# EAGLE schematic Blueberry Pi 7.1.2.esp32.no-lan.gsm-a9g.no-50p (EAGLE 6.1)

## Sheet 1 of 9: IO / LRADC / RTL8237BS / Touch / SPI Flash
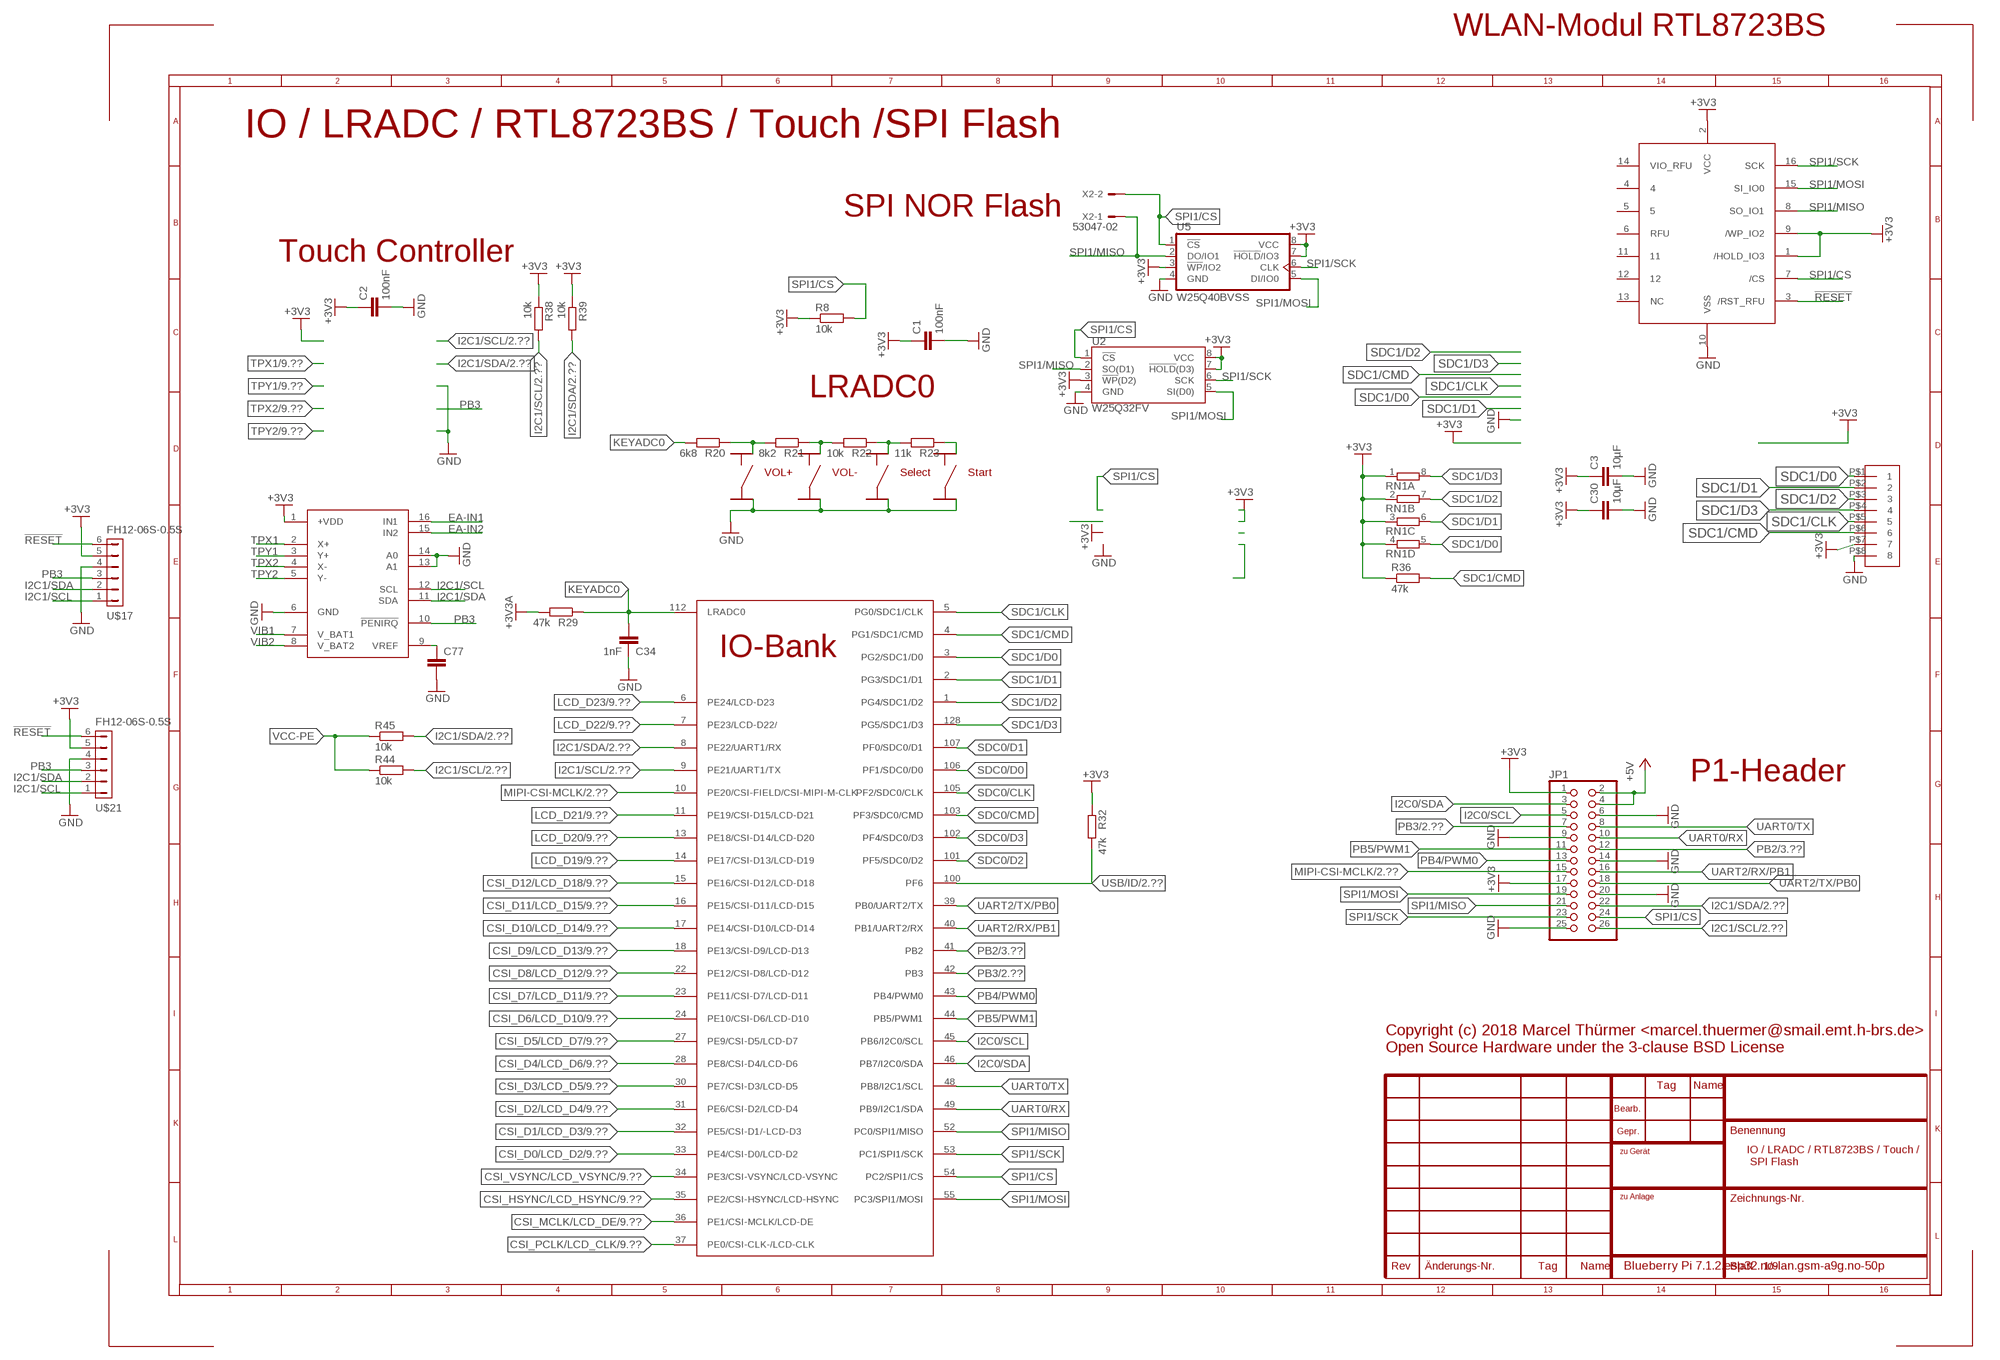
[diagram p0: schematic, sheet 1, part 1 of 2]
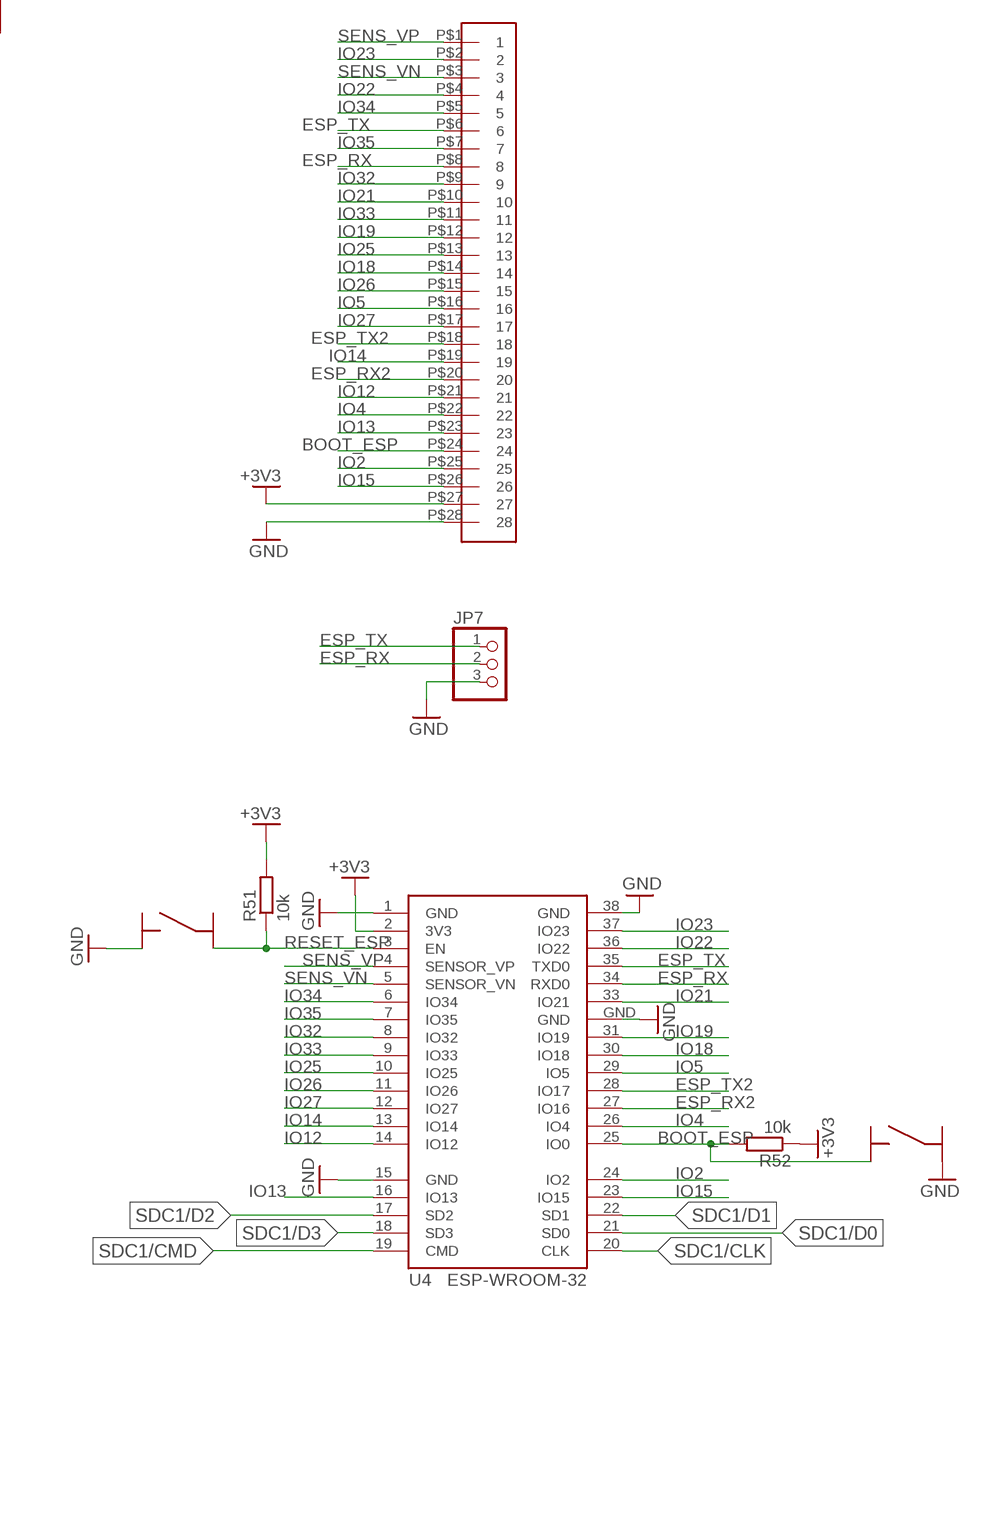
[diagram p1: schematic, sheet 1, part 2 of 2]

### Parts
C1  100nF  C-EUC0603  [C0603]
C2  100nF  C-EUC0603  [C0603]
C3  10µF  C-EUC0805  [C0805]
C30  10µF  C-EUC0805  [C0805]
C34  1nF  C-EUC0603  [C0603]
C77  C-EUC0603  [C0603]
JP1  PINHD-2X13  [2X13]
JP7  PINHD-1X3M  [1X03M]
R8  10k  R-EU_R0603  [R0603]
R20  6k8  R-EU_R0603  [R0603]
R21  8k2  R-EU_R0603  [R0603]
R22  10k  R-EU_R0603  [R0603]
R23  11k  R-EU_R0603  [R0603]
R29  47k  R-EU_R0603  [R0603]
R32  47k  R-EU_R0603  [R0603]
R36  47k  R-EU_R0603  [R0603]
R38  10k  R-EU_R0603  [R0603]
R39  10k  R-EU_R0603  [R0603]
R44  10k  R-EU_R0603  [R0603]
R45  10k  R-EU_R0603  [R0603]
R51  10k  R-EU_R0603  [R0603]
R52  10k  R-EU_R0603  [R0603]
RN1  4R-NEXB38V  [EXB38V]
S-BOOT-ESP  BUTTON_3X3MM_4PINS  [BUT_3X3_4PINS]
S-RST-ESP  BUTTON_3X3MM_4PINS  [BUT_3X3_4PINS]
S-SEL  BUTTON_3X3MM_4PINS  [BUT_3X3_4PINS]
S-START  BUTTON_3X3MM_4PINS  [BUT_3X3_4PINS]
S-VOL+  BUTTON_3X3MM_4PINS  [BUT_3X3_4PINS]
S-VOL-  BUTTON_3X3MM_4PINS  [BUT_3X3_4PINS]
U2  W25Q32FV  W25Q32FVZP  [WSON8-6X5MM]
U4  ESP-WROOM-32  [ESP-WROOM-32]
U5  W25Q40BVSS  [SO08-SS]
U$1  V3S  [QFP-128]
U$3  HDR-1.27MM-142  [HDR-1.27MM-19*2]
U$4  HDR-1.27MM-42  [HDR-1.27MM-4*2]
U$7  TSC2003  [TSSOP16]
U$16  S25FL256S  S25FLSXXX  [WSOIC-16]
U$17  FH12-06S-0.5S  [FH12-6S-0.5SH]
U$21  FH12-06S-0.5S  [FH12-6S-0.5SH]
X2  53047-02  [53047-02]

### Nets
!RESET: U$16.3(/RST_RFU) U$17.6 U$21.6 ; also sheet 3
+3V3: C1.1 C2.1 C3.1 C30.1 JP1.1 JP1.17 R8.1 R32.1 R36.1 R38.1 R39.1 R51.2 R52.1 RN1.1 RN1.2 RN1.3 RN1.4 U2.3(!WP!(D2)) U2.7(!HOLD!(D3)) U2.8(VCC) U4.2(3V3) U5.3(!WP!/IO2) U5.7(!HOLD!/IO3) U5.8(VCC) U$3.P$27 U$4.P$7 U$7.1(+VDD) U$16.1(/HOLD_IO3) U$16.2(VCC) U$16.9(/WP_IO2) U$17.5 U$21.5 ; also sheet 2,3,4,5,7,8,9
+3V3A: R29.2 ; also sheet 2,3
+5V: JP1.2 JP1.4 ; also sheet 2,3,5,6,7,9
BOOT_ESP: R52.2 S-BOOT-ESP.P$1 U4.25(IO0) U$3.P$24
CSI_D0/LCD_D2: U$1.33(PE4/CSI-D0/LCD-D2) ; also sheet 4,9
CSI_D1/LCD_D3: U$1.32(PE5/CSI-D1/-LCD-D3) ; also sheet 4,9
CSI_D2/LCD_D4: U$1.31(PE6/CSI-D2/LCD-D4) ; also sheet 4,9
CSI_D3/LCD_D5: U$1.30(PE7/CSI-D3/LCD-D5) ; also sheet 4,9
CSI_D4/LCD_D6: U$1.28(PE8/CSI-D4/LCD-D6) ; also sheet 4,9
CSI_D5/LCD_D7: U$1.27(PE9/CSI-D5/LCD-D7) ; also sheet 4,9
CSI_D6/LCD_D10: U$1.24(PE10/CSI-D6/LCD-D10) ; also sheet 4,9
CSI_D7/LCD_D11: U$1.23(PE11/CSI-D7/LCD-D11) ; also sheet 4,9
CSI_D8/LCD_D12: U$1.22(PE12/CSI-D8/LCD-D12) ; also sheet 4,9
CSI_D9/LCD_D13: U$1.18(PE13/CSI-D9/LCD-D13) ; also sheet 4,9
CSI_D10/LCD_D14: U$1.17(PE14/CSI-D10/LCD-D14) ; also sheet 4,9
CSI_D11/LCD_D15: U$1.16(PE15/CSI-D11/LCD-D15) ; also sheet 4,9
CSI_D12/LCD_D18: U$1.15(PE16/CSI-D12/LCD-D18) ; also sheet 4,9
CSI_HSYNC/LCD_HSYNC: U$1.35(PE2/CSI-HSYNC/LCD-HSYNC) ; also sheet 4,9
CSI_MCLK/LCD_DE: U$1.36(PE1/CSI-MCLK/LCD-DE) ; also sheet 4,9
CSI_PCLK/LCD_CLK: U$1.37(PE0/CSI-CLK-/LCD-CLK) ; also sheet 4,9
CSI_VSYNC/LCD_VSYNC: U$1.34(PE3/CSI-VSYNC/LCD-VSYNC) ; also sheet 4,9
EA-IN1: U$7.16(IN1) ; also sheet 9
EA-IN2: U$7.15(IN2) ; also sheet 9
ESP_RX: JP7.2 U4.34(RXD0) U$3.P$8
ESP_RX2: U4.27(IO16) U$3.P$20 ; also sheet 8
ESP_TX: JP7.1 U4.35(TXD0) U$3.P$6
ESP_TX2: U4.28(IO17) U$3.P$18 ; also sheet 8
GND: C1.2 C2.2 C3.2 C30.2 C34.1 C77.2 JP1.6 JP1.9 JP1.14 JP1.20 JP1.25 JP7.3 S-BOOT-ESP.P$2 S-RST-ESP.P$1 S-SEL.P$4 S-START.P$4 S-VOL+.P$4 S-VOL-.P$4 U2.4(GND) U4.1(GND) U4.15(GND) U4.38(GND) U4.GND U5.4(GND) U$3.P$28 U$4.P$8 U$7.6(GND) U$7.13(A1) U$7.14(A0) U$16.10(VSS) U$17.4 U$21.4 ; also sheet 2,3,4,5,6,7,8,9
I2C0/SCL: JP1.5 U$1.45(PB6/I2C0/SCL)
I2C0/SDA: JP1.3 U$1.46(PB7/I2C0/SDA)
I2C1/SCL: JP1.26 R38.2 R44.2 U$1.9(PE21/UART1/TX) U$7.12(SCL) U$17.1 U$21.1 ; also sheet 2,9
I2C1/SDA: JP1.22 R39.2 R45.2 U$1.8(PE22/UART1/RX) U$7.11(SDA) U$17.2 U$21.2 ; also sheet 2,9
IO2: U4.24(IO2) U$3.P$25
IO4: U4.26(IO4) U$3.P$22
IO5: U4.29(IO5) U$3.P$16
IO12: U4.14(IO12) U$3.P$21
IO13: U4.16(IO13) U$3.P$23
IO14: U4.13(IO14) U$3.P$19 ; also sheet 8
IO15: U4.23(IO15) U$3.P$26
IO18: U4.30(IO18) U$3.P$14
IO19: U4.31(IO19) U$3.P$12
IO21: U4.33(IO21) U$3.P$10
IO22: U4.36(IO22) U$3.P$4
IO23: U4.37(IO23) U$3.P$2
IO25: U4.10(IO25) U$3.P$13
IO26: U4.11(IO26) U$3.P$15
IO27: U4.12(IO27) U$3.P$17 ; also sheet 8
IO32: U4.8(IO32) U$3.P$9
IO33: U4.9(IO33) U$3.P$11
IO34: U4.6(IO34) U$3.P$5
IO35: U4.7(IO35) U$3.P$7
KEYADC0: C34.2 R20.2 R29.1 U$1.112(LRADC0)
LCD_D19: U$1.14(PE17/CSI-D13/LCD-D19) ; also sheet 4,9
LCD_D20: U$1.13(PE18/CSI-D14/LCD-D20) ; also sheet 4,9
LCD_D21: U$1.11(PE19/CSI-D15/LCD-D21) ; also sheet 4,9
LCD_D22: U$1.7(PE23/LCD-D22/) ; also sheet 4,9
LCD_D23: U$1.6(PE24/LCD-D23) ; also sheet 4,9
MIPI-CSI-MCLK: JP1.15 U$1.10(PE20/CSI-FIELD/CSI-MIPI-M-CLK) ; also sheet 2
N$8: R20.1 R21.2 S-VOL+.P$3
N$11: C77.1 U$7.9(VREF)
N$41: R21.1 R22.2 S-VOL-.P$3
N$42: R22.1 R23.2 S-SEL.P$3
N$43: R23.1 S-START.P$3
PB2: JP1.12 U$1.41(PB2) ; also sheet 3
PB3: JP1.7 U$1.42(PB3) U$7.10(!PENIRQ) U$17.3 U$21.3 ; also sheet 2
PB4/PWM0: JP1.13 U$1.43(PB4/PWM0) ; also sheet 3
PB5/PWM1: JP1.11 U$1.44(PB5/PWM1) ; also sheet 2,7
RESET_ESP: R51.1 S-RST-ESP.P$2 U4.3(EN)
SDC0/CLK: U$1.105(PF2/SDC0/CLK) ; also sheet 2
SDC0/CMD: U$1.103(PF3/SDC0/CMD) ; also sheet 2
SDC0/D0: U$1.106(PF1/SDC0/D0) ; also sheet 2
SDC0/D1: U$1.107(PF0/SDC0/D1) ; also sheet 2
SDC0/D2: U$1.101(PF5/SDC0/D2) ; also sheet 2
SDC0/D3: U$1.102(PF4/SDC0/D3) ; also sheet 2
SDC1/CLK: U4.20(CLK) U$1.5(PG0/SDC1/CLK) U$4.P$5
SDC1/CMD: R36.2 U4.19(CMD) U$1.4(PG1/SDC1/CMD) U$4.P$6
SDC1/D0: RN1.5 U4.21(SD0) U$1.3(PG2/SDC1/D0) U$4.P$1
SDC1/D1: RN1.6 U4.22(SD1) U$1.2(PG3/SDC1/D1) U$4.P$2
SDC1/D2: RN1.7 U4.17(SD2) U$1.1(PG4/SDC1/D2) U$4.P$3
SDC1/D3: RN1.8 U4.18(SD3) U$1.128(PG5/SDC1/D3) U$4.P$4
SENS_VN: U4.5(SENSOR_VN) U$3.P$3
SENS_VP: U4.4(SENSOR_VP) U$3.P$1
SPI1/CS: JP1.24 R8.2 U2.1(!CS!) U5.1(!CS!) U$1.54(PC2/SPI1/CS) U$16.7(/CS) X2.2
SPI1/MISO: JP1.21 U2.2(SO(D1)) U5.2(DO/IO1) U$1.52(PC0/SPI1/MISO) U$16.8(SO_IO1) X2.1
SPI1/MOSI: JP1.19 U2.5(SI(D0)) U5.5(DI/IO0) U$1.55(PC3/SPI1/MOSI) U$16.15(SI_IO0)
SPI1/SCK: JP1.23 U2.6(SCK) U5.6(CLK) U$1.53(PC1/SPI1/SCK) U$16.16(SCK)
TPX1: U$7.2(X+) ; also sheet 9
TPX2: U$7.4(X-) ; also sheet 9
TPY1: U$7.3(Y+) ; also sheet 9
TPY2: U$7.5(Y-) ; also sheet 9
UART0/RX: JP1.10 U$1.49(PB9/I2C1/SDA)
UART0/TX: JP1.8 U$1.48(PB8/I2C1/SCL)
UART2/RX/PB1: JP1.16 U$1.40(PB1/UART2/RX) ; also sheet 8
UART2/TX/PB0: JP1.18 U$1.39(PB0/UART2/TX) ; also sheet 8
USB/ID: R32.2 U$1.100(PF6) ; also sheet 2
VCC-PE: R44.1 R45.1
VIB1: U$7.7(V_BAT1) ; also sheet 9
VIB2: U$7.8(V_BAT2) ; also sheet 9
Unconnected: S-BOOT-ESP.P$3 S-BOOT-ESP.P$4 S-RST-ESP.P$3 S-RST-ESP.P$4 S-SEL.P$1 S-SEL.P$2 S-START.P$1 S-START.P$2 S-VOL+.P$1 S-VOL+.P$2 S-VOL-.P$1 S-VOL-.P$2 U$16.4 U$16.5 U$16.6(RFU) U$16.11 U$16.12 U$16.13(NC) U$16.14(VIO_RFU)

### Notes on the sheet
- WLAN-Modul RTL8723BS
- IO / LRADC / RTL8723BS / Touch /SPI Flash
- SPI NOR Flash
- Touch Controller
- LRADC0
- VOL+ | VOL- | Select | Start
- P1-Header
- Copyright (c) 2018 Marcel Thürmer <marcel.thuermer@smail.emt.h-brs.de>
  Open Source Hardware under the 3-clause BSD License
- IO / LRADC / RTL8723BS / Touch /
   SPI Flash

## Sheet 2 of 9: Ethernet / USB Host / SDC0 / Audio / MIPI CSI
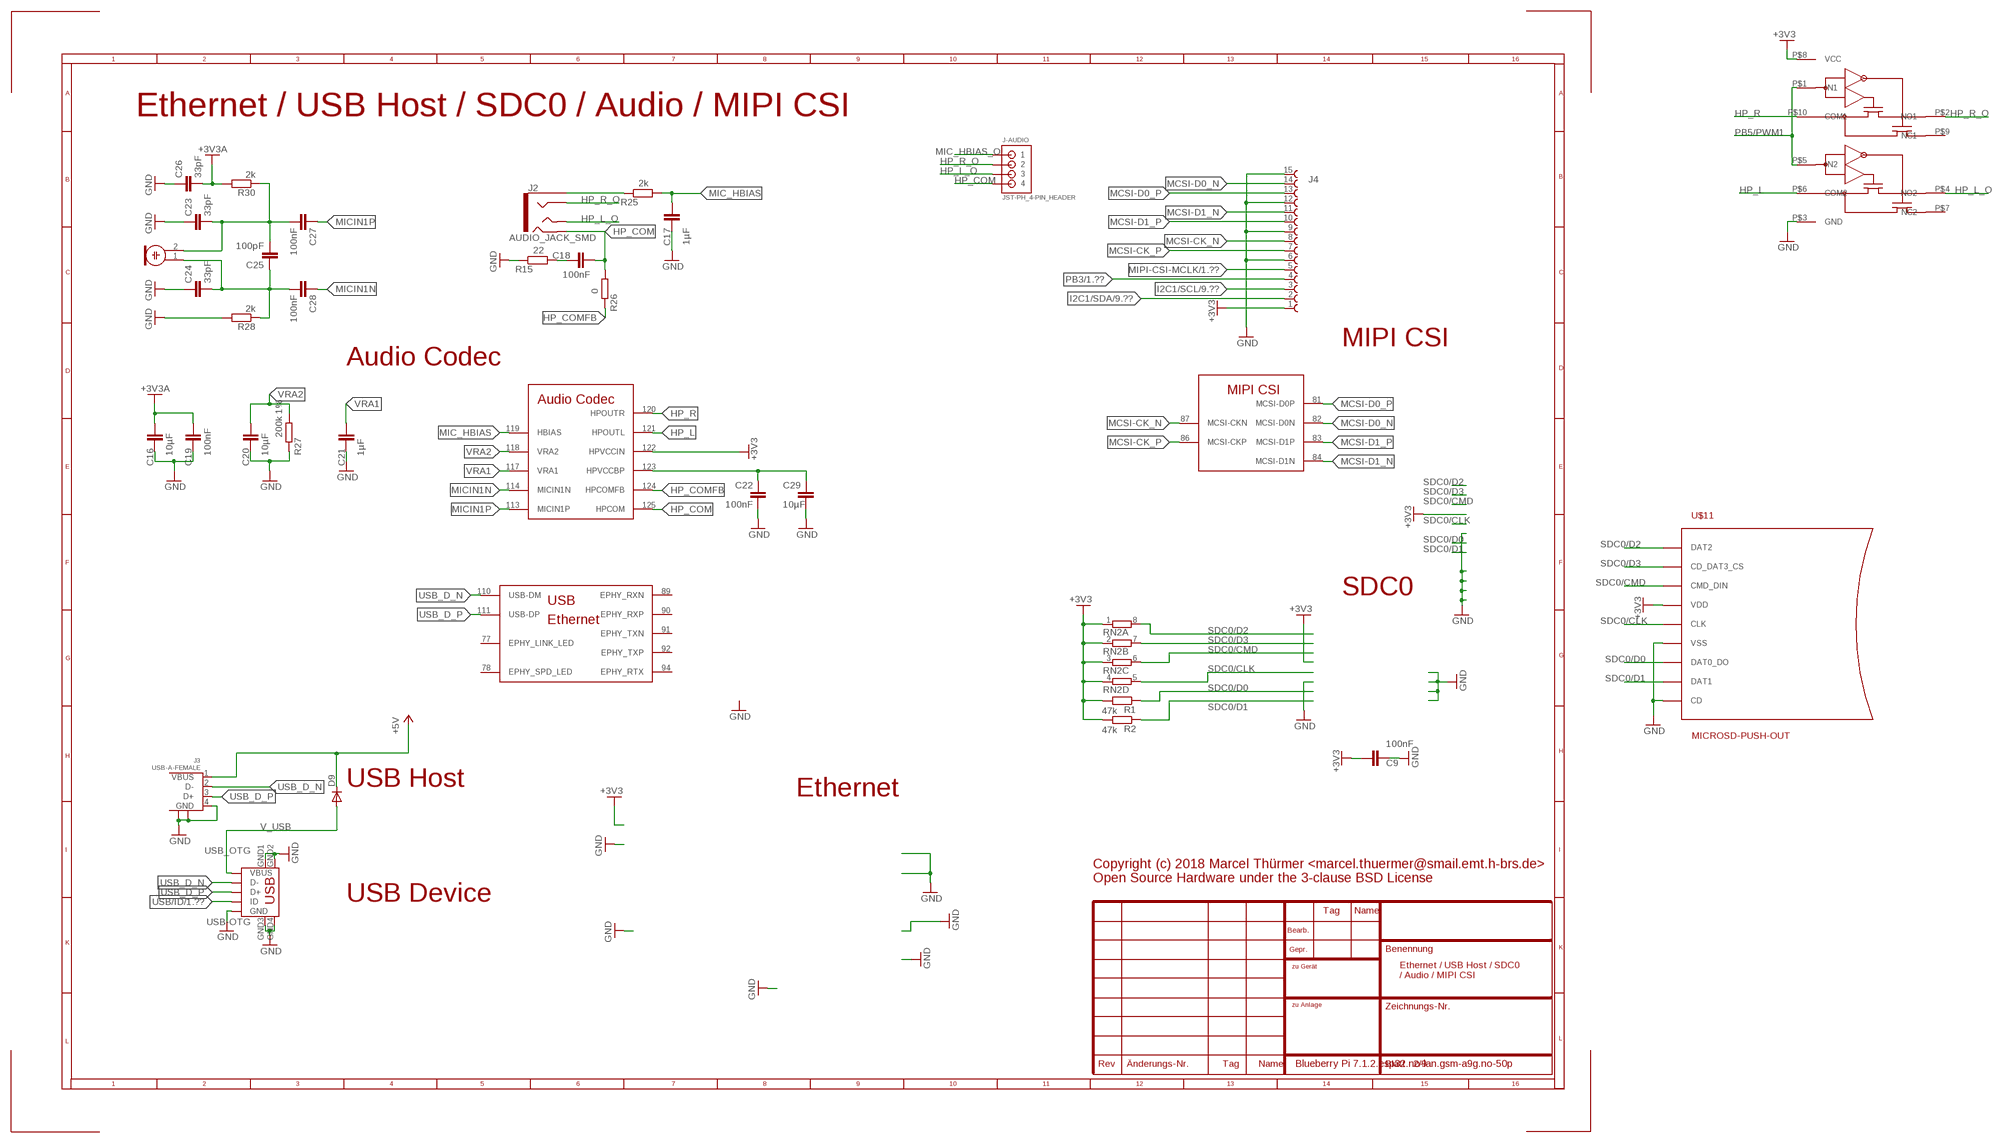
[diagram p2: schematic, sheet 2]

### Parts
C9  100nF  C-EUC0603  [C0603]
C16  10µF  C-EUC0805  [C0805]
C17  1µF  C-EUC0603  [C0603]
C18  100nF  C-EUC0603  [C0603]
C19  100nF  C-EUC0603  [C0603]
C20  10µF  C-EUC0805  [C0805]
C21  1µF  C-EUC0603  [C0603]
C22  100nF  C-EUC0603  [C0603]
C23  33pF  C-EUC0603  [C0603]
C24  33pF  C-EUC0603  [C0603]
C25  100pF  C-EUC0603  [C0603]
C26  33pF  C-EUC0603  [C0603]
C27  100nF  C-EUC0603  [C0603]
C28  100nF  C-EUC0603  [C0603]
C29  10µF  C-EUC0805  [C0805]
D9  DIODE-SOD323-W  [SOD323-W]
J2  AUDIO_JACK_SMD  AUDIO_JACK_TRRSSMD_RA  [AUDIO_JACK_3.5MM_TRRS_SMD_RA]
J3  USB-A-FEMALE  [USB-A-FEMALE]
J4  68611514122  [68611514122]
J-AUDIO  JST-PH_4-PIN_HEADER  [JST_B4B-PH_HEADER]
MIC  ELECTRET_MICROPHON-F6035AP  [F6035AP]
R1  47k  R-EU_R0603  [R0603]
R2  47k  R-EU_R0603  [R0603]
R15  22  R-EU_R0603  [R0603]
R25  2k  R-EU_R0603  [R0603]
R26  0  R-EU_R0603  [R0603]
R27  200k 1%  R-EU_R0603  [R0603]
R28  2k  R-EU_R0603  [R0603]
R30  2k  R-EU_R0603  [R0603]
RN2  4R-NEXB38V  [EXB38V]
U$11  MICROSD-PUSH-OUT  [MICROSD-PUSH-OUT]
U$24  TS5A23157  [TS5A23157]
USB_OTG  USB-OTG  MINI_USB9  [USB_MINI_9PIN]

### Nets
+3V3: C9.1 J4.1 R1.2 R2.2 RN2.1 RN2.2 RN2.3 RN2.4 U$1.122(HPVCCIN) U$11.4(VDD) U$24.P$8(VCC) ; also sheet 1,3,4,5,7,8,9
+3V3A: C16.2 C19.2 C26.2 R30.2 ; also sheet 1,3
+5V: D9.C J3.1(VBUS) ; also sheet 1,3,5,6,7,9
GND: C9.2 C16.1 C17.2 C19.1 C20.1 C21.1 C22.2 C23.1 C24.1 C26.1 C29.1 J3.4(GND) J3.P$1 J3.P$2 J4.6 J4.9 J4.12 J4.15 R15.1 R27.1 R28.2 U$11.6(VSS) U$11.CD U$11.G1(VSS) U$11.G2(VSS) U$11.G3(VSS) U$11.G4(VSS) U$24.P$3(GND) USB_OTG.GND USB_OTG.GND1 USB_OTG.GND2 USB_OTG.GND3 USB_OTG.GND4 ; also sheet 1,3,4,5,6,7,8,9
HP_COM: C18.2 J2.RING2 J-AUDIO.P4 R26.2 U$1.125(HPCOM)
HP_COMFB: R26.1 U$1.124(HPCOMFB)
HP_L: U$1.121(HPOUTL) U$24.P$6(COM2)
HP_L_O: J2.TIP J-AUDIO.P3 U$24.P$4(NO2)
HP_R: U$1.120(HPOUTR) U$24.P$10(COM1) ; also sheet 7
HP_R_O: J2.RING1 J-AUDIO.P2 U$24.P$2(NO1)
I2C1/SCL: J4.3 ; also sheet 1,9
I2C1/SDA: J4.2 ; also sheet 1,9
MCSI-CK_N: J4.8 U$1.87(MCSI-CKN)
MCSI-CK_P: J4.7 U$1.86(MCSI-CKP)
MCSI-D0_N: J4.14 U$1.82(MCSI-D0N)
MCSI-D0_P: J4.13 U$1.81(MCSI-D0P)
MCSI-D1_N: J4.11 U$1.84(MCSI-D1N)
MCSI-D1_P: J4.10 U$1.83(MCSI-D1P)
MIC_HBIAS: C17.1 R25.2 U$1.119(HBIAS)
MIC_HBIAS_O: J2.EARTH J-AUDIO.P1 R25.1
MICIN1N: C28.1 U$1.114(MICIN1N)
MICIN1P: C27.1 U$1.113(MICIN1P) ; also sheet 7
MIPI-CSI-MCLK: J4.5 ; also sheet 1
N$28: C22.1 C29.2 U$1.123(HPVCCBP)
N$47: C18.1 R15.2
N$48: C23.2 C25.2 C27.2 MIC.2 R30.1
N$49: C24.2 C25.1 C28.2 MIC.1 R28.1
PB3: J4.4 ; also sheet 1
PB5/PWM1: U$24.P$1(IN1) U$24.P$5(IN2) ; also sheet 1,7
SDC0/CLK: RN2.5 U$11.5(CLK) ; also sheet 1
SDC0/CMD: RN2.6 U$11.3(CMD_DIN) ; also sheet 1
SDC0/D0: R1.1 U$11.7(DAT0_DO) ; also sheet 1
SDC0/D1: R2.1 U$11.8(DAT1) ; also sheet 1
SDC0/D2: RN2.8 U$11.1(DAT2) ; also sheet 1
SDC0/D3: RN2.7 U$11.2(CD_DAT3_CS) ; also sheet 1
USB/ID: USB_OTG.ID ; also sheet 1
USB_D_N: J3.2(D-) U$1.110(USB-DM) USB_OTG.D-
USB_D_P: J3.3(D+) U$1.111(USB-DP) USB_OTG.D+
V_USB: D9.A USB_OTG.VBUS ; also sheet 3,6,8
VRA1: C21.2 U$1.117(VRA1)
VRA2: C20.2 R27.2 U$1.118(VRA2)
Unconnected: U$1.77(EPHY_LINK_LED) U$1.78(EPHY_SPD_LED) U$1.89(EPHY_RXN) U$1.90(EPHY_RXP) U$1.91(EPHY_TXN) U$1.92(EPHY_TXP) U$1.94(EPHY_RTX) U$24.P$7(NC2) U$24.P$9(NC1)

### Notes on the sheet
- Ethernet / USB Host / SDC0 / Audio / MIPI CSI
- MIPI CSI
- Audio Codec
- SDC0
- USB Host
- Ethernet
- Copyright (c) 2018 Marcel Thürmer <marcel.thuermer@smail.emt.h-brs.de>
  Open Source Hardware under the 3-clause BSD License
- USB Device
- Ethernet / USB Host / SDC0 
  / Audio / MIPI CSI

## Sheet 3 of 9: VCC / RTC / PLL
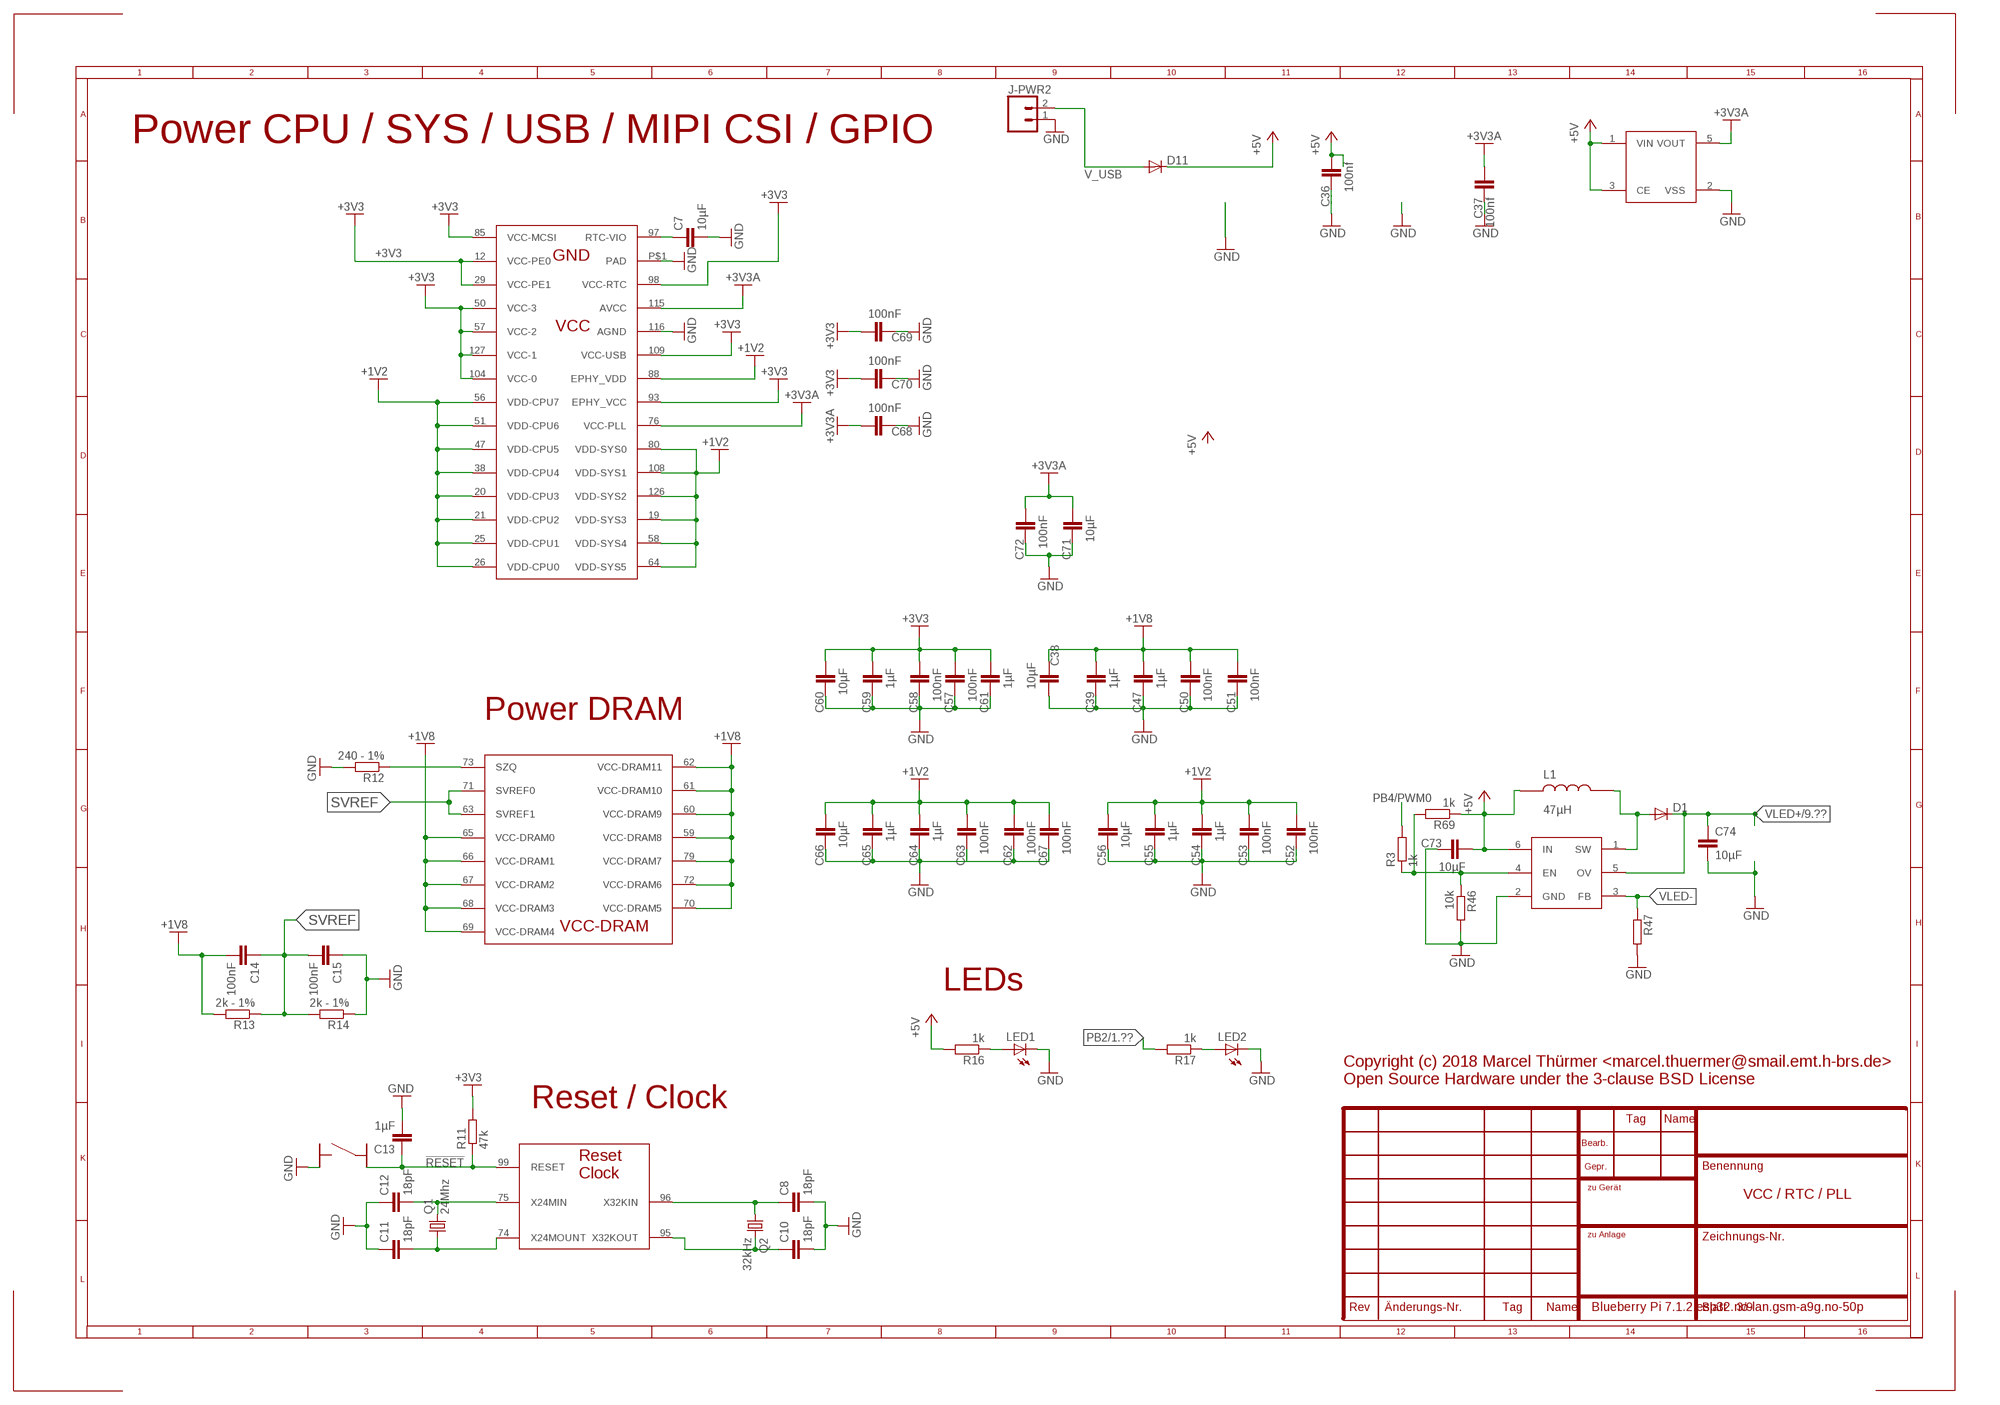
[diagram p3: schematic, sheet 3]

### Parts
C7  10µF  C-EUC0805  [C0805]
C8  18pF  C-EUC0603  [C0603]
C10  18pF  C-EUC0603  [C0603]
C11  18pF  C-EUC0603  [C0603]
C12  18pF  C-EUC0603  [C0603]
C13  1µF  C-EUC0603  [C0603]
C14  100nF  C-EUC0603  [C0603]
C15  100nF  C-EUC0603  [C0603]
C36  100nf  C-EUC0603  [C0603]
C37  100nf  C-EUC0603  [C0603]
C38  10µF  C-EUC0805  [C0805]
C39  1µF  C-EUC0603  [C0603]
C47  1µF  C-EUC0603  [C0603]
C50  100nF  C-EUC0603  [C0603]
C51  100nF  C-EUC0603  [C0603]
C52  100nF  C-EUC0603  [C0603]
C53  100nF  C-EUC0603  [C0603]
C54  1µF  C-EUC0603  [C0603]
C55  1µF  C-EUC0603  [C0603]
C56  10µF  C-EUC0805  [C0805]
C57  100nF  C-EUC0603  [C0603]
C58  100nF  C-EUC0603  [C0603]
C59  1µF  C-EUC0603  [C0603]
C60  10µF  C-EUC0805  [C0805]
C61  1µF  C-EUC0603  [C0603]
C62  100nF  C-EUC0603  [C0603]
C63  100nF  C-EUC0603  [C0603]
C64  1µF  C-EUC0603  [C0603]
C65  1µF  C-EUC0603  [C0603]
C66  10µF  C-EUC0805  [C0805]
C67  100nF  C-EUC0603  [C0603]
C68  100nF  C-EUC0603  [C0603]
C69  100nF  C-EUC0603  [C0603]
C70  100nF  C-EUC0603  [C0603]
C71  10µF  C-EUC0805  [C0805]
C72  100nF  C-EUC0603  [C0603]
C73  10µF  C-EUC0805  [C0805]
C74  10µF  C-EUC0805  [C0805]
D1  DIODE-SOD323-W  [SOD323-W]
D11  DIODE-SOD323-W  [SOD323-W]
J-PWR2  CONN_02  [1X02]
L1  47µH  INDUCTANCE_CD32  [CD32]
LED1  LEDCHIPLED_0805  [CHIPLED_0805]
LED2  LEDCHIPLED_0805  [CHIPLED_0805]
Q1  24Mhz  CRYSTALHC49U-V  [HC49U-V]
Q2  32kHz  CRYSTALTC38H  [TC38H]
R3  1k  R-EU_R0603  [R0603]
R11  47k  R-EU_R0603  [R0603]
R12  240 - 1%  R-EU_R0603  [R0603]
R13  2k - 1%  R-EU_R0603  [R0603]
R14  2k - 1%  R-EU_R0603  [R0603]
R16  1k  R-EU_R0603  [R0603]
R17  1k  R-EU_R0603  [R0603]
R46  10k  R-EU_R0603  [R0603]
R47  R-EU_R0603  [R0603]
R69  1k  R-EU_R0603  [R0603]
S-RST  BUTTON_3X3MM_4PINS  [BUT_3X3_4PINS]
U$9  PT4101  [SOT23-6]
U$15  XC6204  XC6204XC6204  [SOT25]

### Nets
!RESET: C13.1 R11.1 S-RST.P$2 U$1.99(RESET) ; also sheet 1
+1V2: C52.1 C53.1 C54.1 C55.1 C56.1 C62.1 C63.1 C64.1 C65.1 C66.1 C67.1 U$1.19(VDD-SYS3) U$1.20(VDD-CPU3) U$1.21(VDD-CPU2) U$1.25(VDD-CPU1) U$1.26(VDD-CPU0) U$1.38(VDD-CPU4) U$1.47(VDD-CPU5) U$1.51(VDD-CPU6) U$1.56(VDD-CPU7) U$1.58(VDD-SYS4) U$1.64(VDD-SYS5) U$1.80(VDD-SYS0) U$1.88(EPHY_VDD) U$1.108(VDD-SYS1) U$1.126(VDD-SYS2) ; also sheet 5,9
+1V8: C14.2 C38.2 C39.1 C47.1 C50.1 C51.1 R13.2 U$1.59(VCC-DRAM8) U$1.60(VCC-DRAM9) U$1.61(VCC-DRAM10) U$1.62(VCC-DRAM11) U$1.65(VCC-DRAM0) U$1.66(VCC-DRAM1) U$1.67(VCC-DRAM2) U$1.68(VCC-DRAM3) U$1.69(VCC-DRAM4) U$1.70(VCC-DRAM5) U$1.72(VCC-DRAM6) U$1.79(VCC-DRAM7) ; also sheet 5,9
+3V3: C57.1 C58.1 C59.1 C60.1 C61.1 C69.1 C70.1 R11.2 U$1.12(VCC-PE0) U$1.29(VCC-PE1) U$1.50(VCC-3) U$1.57(VCC-2) U$1.85(VCC-MCSI) U$1.93(EPHY_VCC) U$1.98(VCC-RTC) U$1.104(VCC-0) U$1.109(VCC-USB) U$1.127(VCC-1) ; also sheet 1,2,4,5,7,8,9
+3V3A: C37.1 C68.1 C71.1 C72.1 U$1.76(VCC-PLL) U$1.115(AVCC) U$15.5(VOUT) ; also sheet 1,2
+5V: C36.1 C73.1 D11.C L1.P$1 R16.2 R69.1 U$9.6(IN) U$15.1(VIN) U$15.3(CE) ; also sheet 1,2,5,6,7,9
GND: C7.2 C8.2 C10.2 C11.1 C12.1 C13.2 C15.1 C36.2 C37.2 C38.1 C39.2 C47.2 C50.2 C51.2 C52.2 C53.2 C54.2 C55.2 C56.2 C57.2 C58.2 C59.2 C60.2 C61.2 C62.2 C63.2 C64.2 C65.2 C66.2 C67.2 C68.2 C69.2 C70.2 C71.2 C72.2 C73.2 C74.2 J-PWR2.1 LED1.C LED2.C R12.2 R14.1 R46.2 R47.2 S-RST.P$1 U$1.116(AGND) U$1.P$1(PAD) U$9.2(GND) U$15.2(VSS) ; also sheet 1,2,4,5,6,7,8,9
N$3: LED1.A R16.1
N$6: LED2.A R17.1
N$9: R3.1 R46.1 R69.2 U$9.4(EN)
N$10: D1.A L1.P$2 U$9.1(SW)
N$23: C7.1 U$1.97(RTC-VIO)
N$29: C10.1 Q2.2 U$1.95(X32KOUT)
N$30: C8.1 Q2.1 U$1.96(X32KIN)
N$32: C11.2 Q1.1 U$1.74(X24MOUNT)
N$33: C12.2 Q1.2 U$1.75(X24MIN)
N$36: R12.1 U$1.73(SZQ)
PB2: R17.2 ; also sheet 1
PB4/PWM0: R3.2 ; also sheet 1
SVREF: C14.1 C15.2 R13.1 R14.2 U$1.63(SVREF1) U$1.71(SVREF0)
V_USB: D11.A J-PWR2.2 ; also sheet 2,6,8
VLED+: C74.1 D1.C U$9.5(OV) ; also sheet 9
VLED-: R47.1 U$9.3(FB) ; also sheet 9
Unconnected: S-RST.P$3 S-RST.P$4

### Notes on the sheet
- Power CPU / SYS / USB / MIPI CSI / GPIO
- Power DRAM
- LEDs
- Copyright (c) 2018 Marcel Thürmer <marcel.thuermer@smail.emt.h-brs.de>
  Open Source Hardware under the 3-clause BSD License
- Reset / Clock
- VCC / RTC / PLL

## Sheet 4 of 9: sn65lvds84
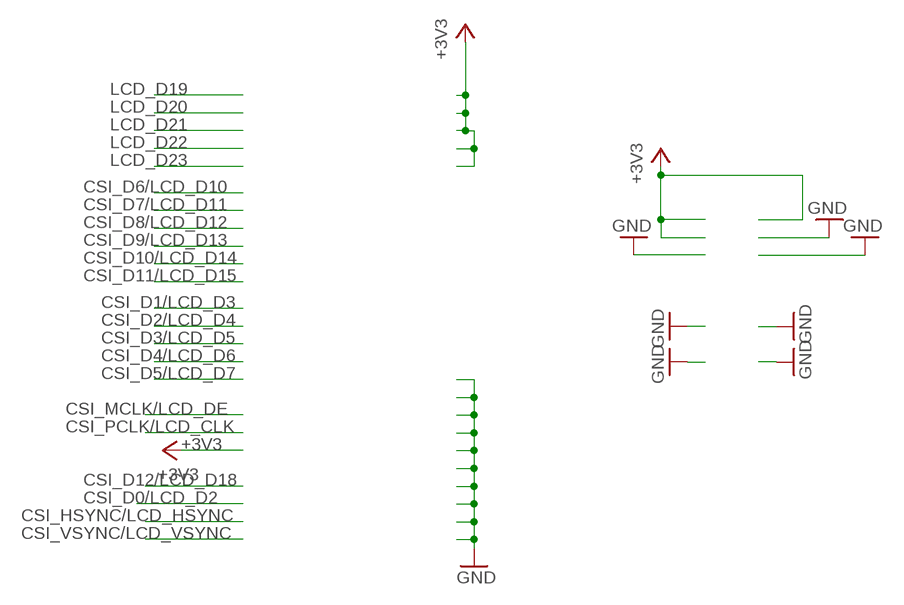
[diagram p4: schematic, sheet 4]

## Sheet 5 of 9
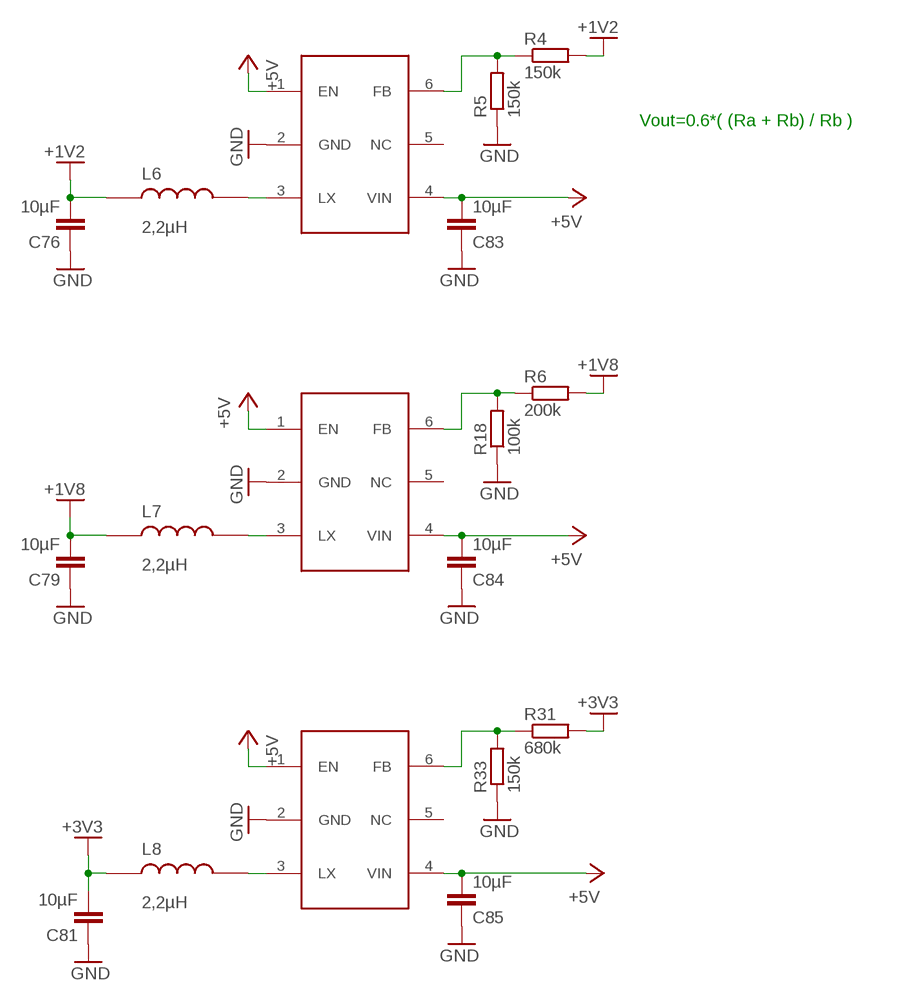
[diagram p5: schematic, sheet 5]

### Parts
C76  10µF  C-EUC0805  [C0805]
C79  10µF  C-EUC0805  [C0805]
C81  10µF  C-EUC0805  [C0805]
C83  10µF  C-EUC0805  [C0805]
C84  10µF  C-EUC0805  [C0805]
C85  10µF  C-EUC0805  [C0805]
L6  2,2µH  INDUCTANCE_CD32  [CD32]
L7  2,2µH  INDUCTANCE_CD32  [CD32]
L8  2,2µH  INDUCTANCE_CD32  [CD32]
R4  150k  R-EU_R0603  [R0603]
R5  150k  R-EU_R0603  [R0603]
R6  200k  R-EU_R0603  [R0603]
R18  100k  R-EU_R0603  [R0603]
R31  680k  R-EU_R0603  [R0603]
R33  150k  R-EU_R0603  [R0603]
U$5  STI3411  [SOT23-6]
U$12  STI3411  [SOT23-6]
U$13  STI3411  [SOT23-6]

### Nets
+1V2: C76.2 L6.P$1 R4.2 ; also sheet 3,9
+1V8: C79.2 L7.P$1 R6.2 ; also sheet 3,9
+3V3: C81.2 L8.P$1 R31.2 ; also sheet 1,2,3,4,7,8,9
+5V: C83.2 C84.2 C85.2 U$5.1(EN) U$5.4(VIN) U$12.1(EN) U$12.4(VIN) U$13.1(EN) U$13.4(VIN) ; also sheet 1,2,3,6,7,9
GND: C76.1 C79.1 C81.1 C83.1 C84.1 C85.1 R5.1 R18.1 R33.1 U$5.2(GND) U$12.2(GND) U$13.2(GND) ; also sheet 1,2,3,4,6,7,8,9
N$2: L6.P$2 U$13.3(LX)
N$5: L7.P$2 U$5.3(LX)
N$15: R4.1 R5.2 U$13.6(FB)
N$16: L8.P$2 U$12.3(LX)
N$26: R6.1 R18.2 U$5.6(FB)
N$31: R31.1 R33.2 U$12.6(FB)
Unconnected: U$5.5(NC) U$12.5(NC) U$13.5(NC)

### Notes on the sheet
- Vout=0.6*( (Ra + Rb) / Rb )

## Sheet 6 of 9
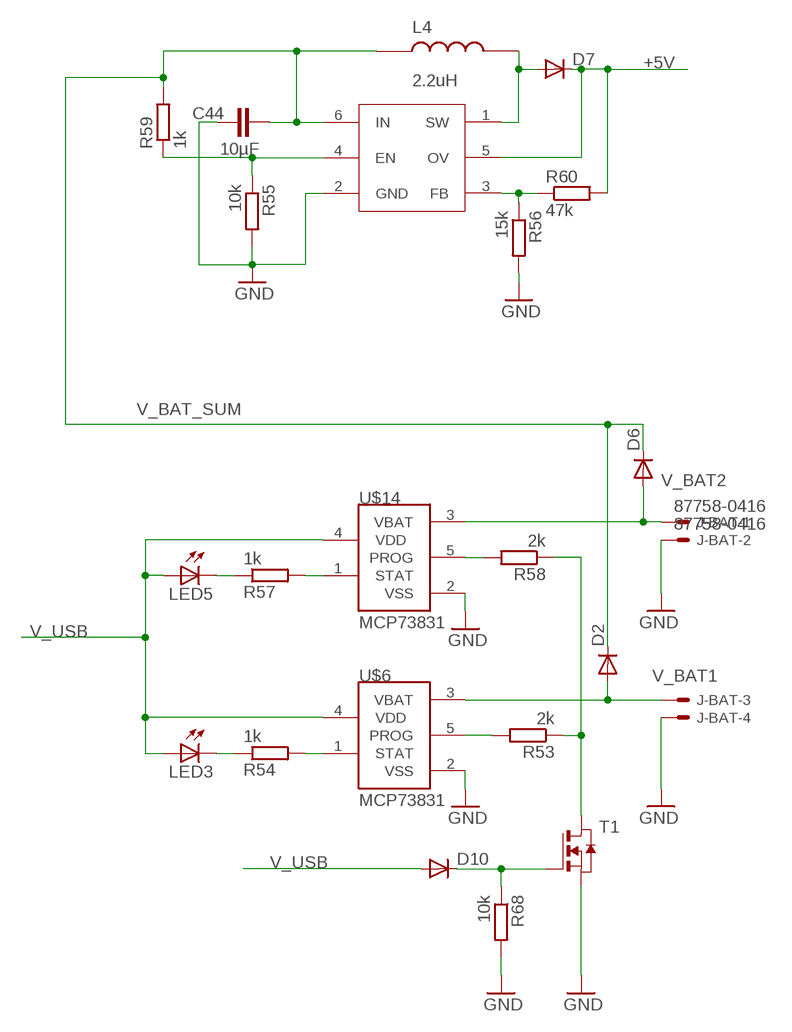
[diagram p6: schematic, sheet 6]

### Parts
C44  10µF  C-EUC0805  [C0805]
D2  DIODE-DO214AC  [DO214AC]
D6  DIODE-DO214AC  [DO214AC]
D7  DIODE-SOD323-W  [SOD323-W]
D10  DIODE-SOD323-W  [SOD323-W]
J-BAT  87758-0416  [87758-0416]
L4  2.2uH  INDUCTANCE_CD32  [CD32]
LED3  LEDCHIPLED_0805  [CHIPLED_0805]
LED5  LEDCHIPLED_0805  [CHIPLED_0805]
R53  2k  R-EU_R0603  [R0603]
R54  1k  R-EU_R0603  [R0603]
R55  10k  R-EU_R0603  [R0603]
R56  15k  R-EU_R0603  [R0603]
R57  1k  R-EU_R0603  [R0603]
R58  2k  R-EU_R0603  [R0603]
R59  1k  R-EU_R0603  [R0603]
R60  47k  R-EU_R0603  [R0603]
R68  10k  R-EU_R0603  [R0603]
T1  NMOSSOT23  [SOT-23]
U$6  MCP73831  [SOT23-5L]
U$10  PT4101  [SOT23-6]
U$14  MCP73831  [SOT23-5L]

### Nets
+5V: D7.C R60.2 U$10.5(OV) ; also sheet 1,2,3,5,7,9
GND: C44.2 J-BAT.2 J-BAT.4 R55.2 R56.2 R68.2 T1.2(S) U$6.2(VSS) U$10.2(GND) U$14.2(VSS) ; also sheet 1,2,3,4,5,7,8,9
N$1: R53.1 R58.1 T1.1(D)
N$7: R56.1 R60.1 U$10.3(FB)
N$12: R55.1 R59.1 U$10.4(EN)
N$13: D7.A L4.P$2 U$10.1(SW)
N$18: D10.C R68.1 T1.3(G)
N$19: R53.2 U$6.5(PROG)
N$35: LED3.C R54.1
N$38: R54.2 U$6.1(STAT)
N$46: R58.2 U$14.5(PROG)
N$50: R57.2 U$14.1(STAT)
N$51: LED5.C R57.1
V_BAT1: D2.A J-BAT.3 U$6.3(VBAT)
V_BAT2: D6.A J-BAT.1 U$14.3(VBAT)
V_BAT_SUM: C44.1 D2.C D6.C L4.P$1 R59.2 U$10.6(IN) ; also sheet 7,8
V_USB: D10.A LED3.A LED5.A U$6.4(VDD) U$14.4(VDD) ; also sheet 2,3,8

## Sheet 7 of 9
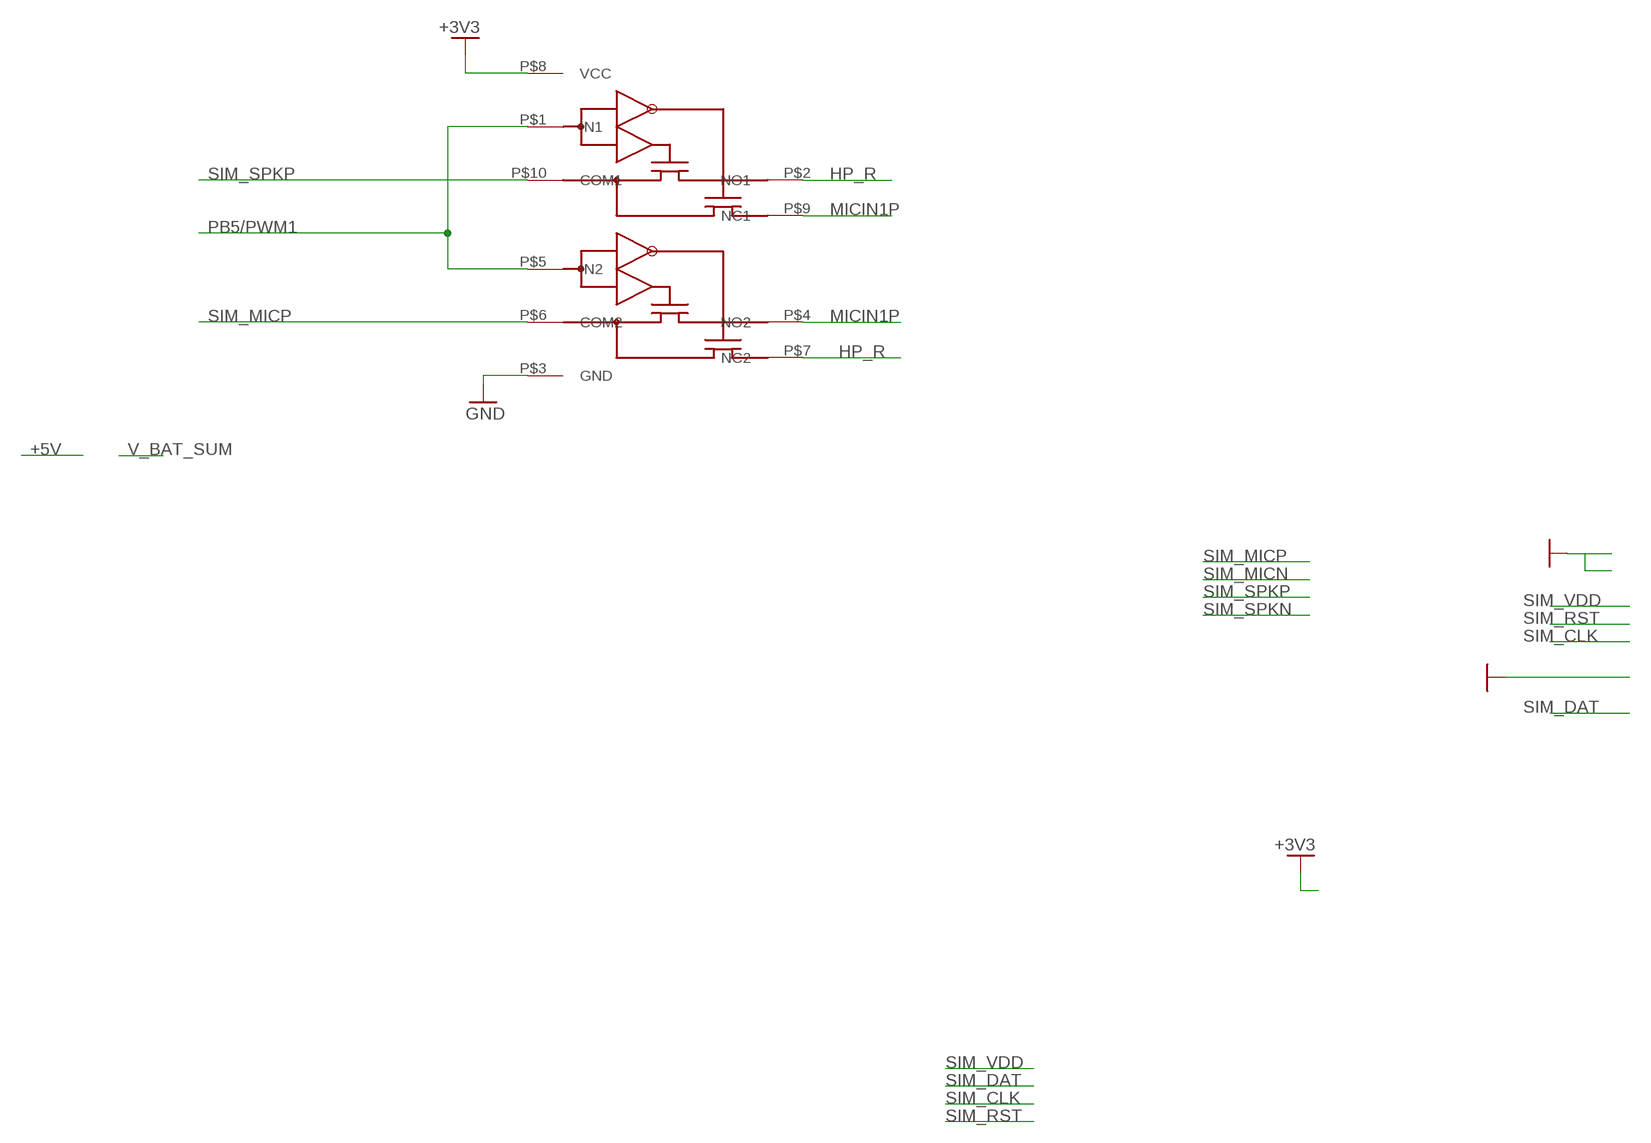
[diagram p7: schematic, sheet 7]

### Parts
U$19  TS5A23157  [TS5A23157]

### Nets
+3V3: U$19.P$8(VCC) ; also sheet 1,2,3,4,5,8,9
GND: U$19.P$3(GND) ; also sheet 1,2,3,4,5,6,8,9
HP_R: U$19.P$2(NO1) U$19.P$7(NC2) ; also sheet 2
MICIN1P: U$19.P$4(NO2) U$19.P$9(NC1) ; also sheet 2
PB5/PWM1: U$19.P$1(IN1) U$19.P$5(IN2) ; also sheet 1,2
SIM_MICP: U$19.P$6(COM2) ; also sheet 8
SIM_SPKP: U$19.P$10(COM1) ; also sheet 8

## Sheet 8 of 9
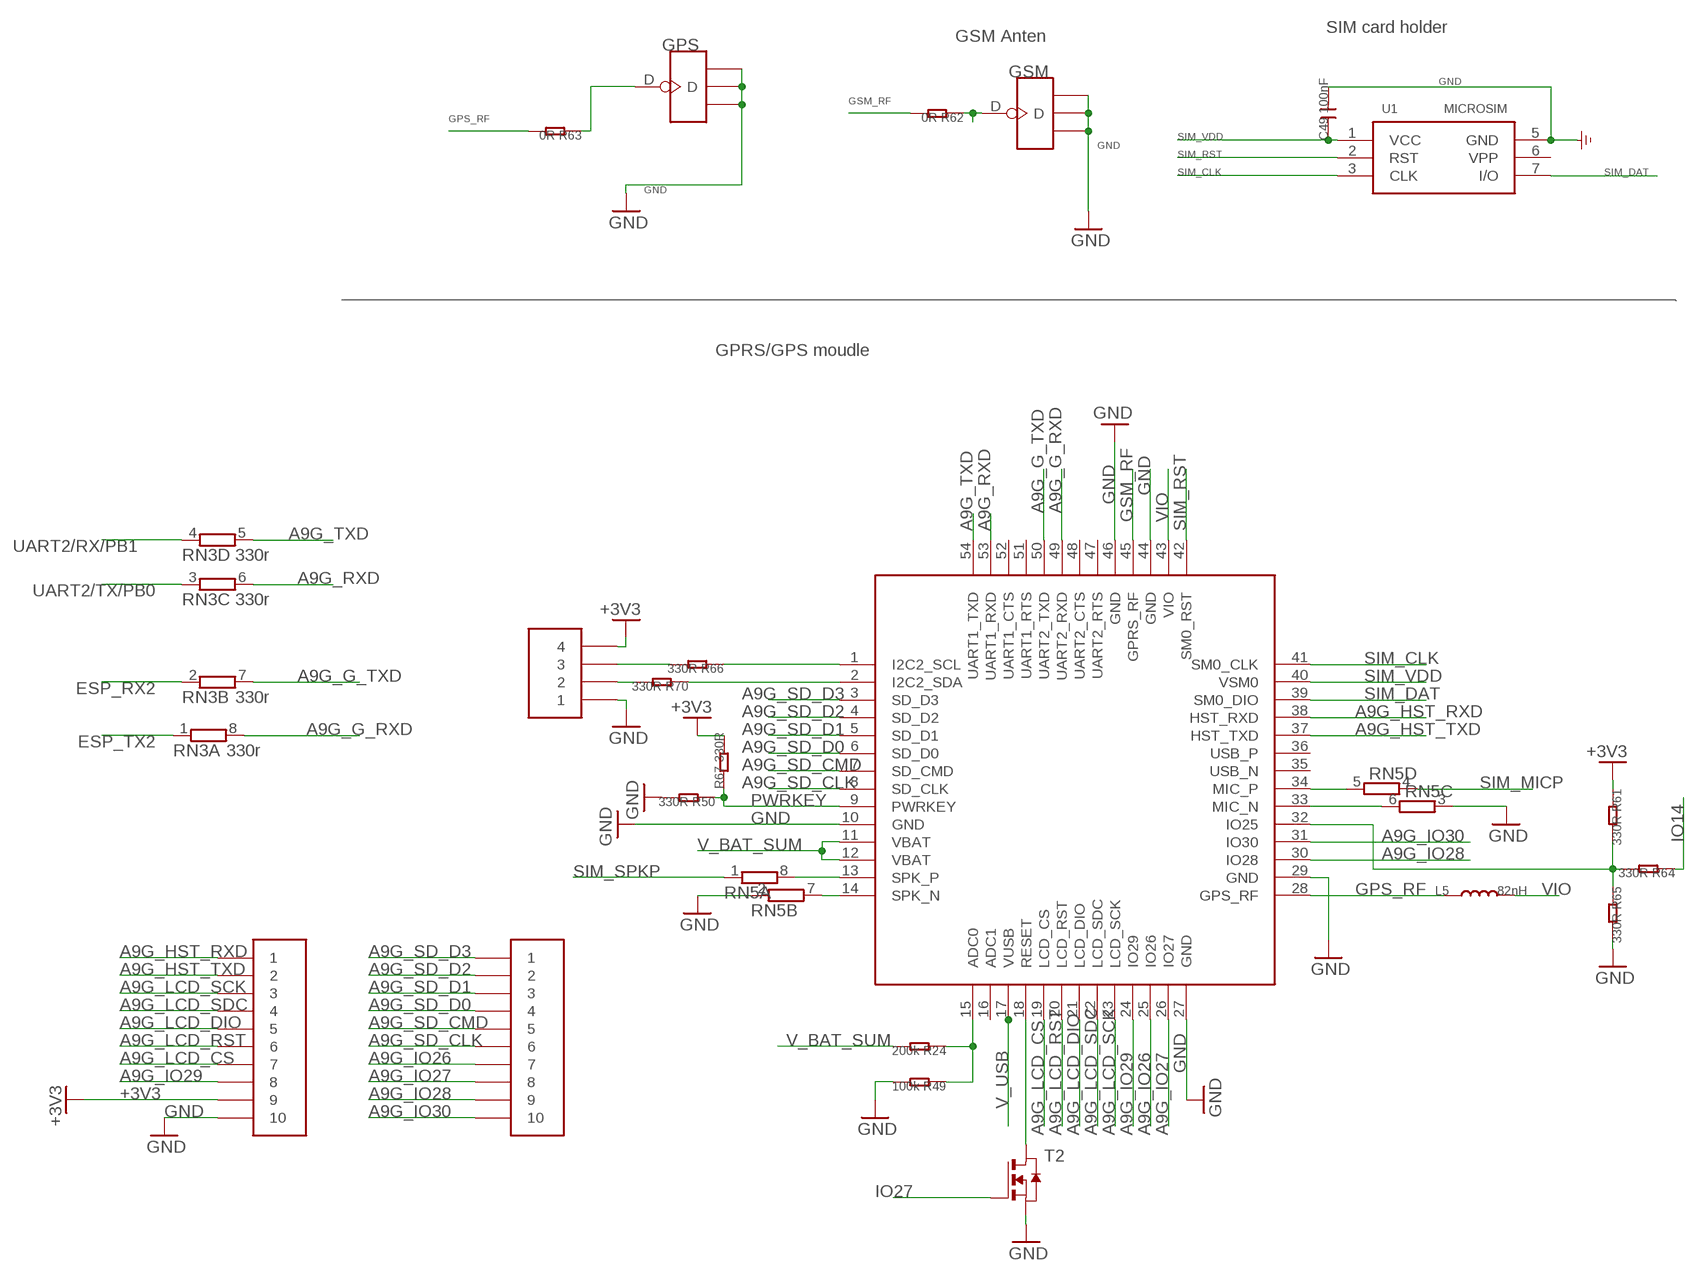
[diagram p8: schematic, sheet 8]

### Parts
C49  100nF  C-0603  [C0603]
DBG-COM1  HDR-1.27MM-110  [HDR-1.27MM-1*10]
DBG-COM2  HDR-1.27MM-110  [HDR-1.27MM-1*10]
GPS  ANTENNA-U-FL  [4P-U-FL]
GSM  ANTENNA-U-FL  [4P-U-FL]
L5  82nH  L'0603'  [L0603]
R24  200k  R-0603  [R0603]
R49  100k  R-0603  [R0603]
R50  330R  R-0603  [R0603]
R61  330R  R-0603  [R0603]
R62  0R  R-0603  [R0603]
R63  0R  R-0603  [R0603]
R64  330R  R-0603  [R0603]
R65  330R  R-0603  [R0603]
R66  330R  R-0603  [R0603]
R67  330R  R-0603  [R0603]
R70  330R  R-0603  [R0603]
RN3  330r  4R-NEXB38V  [EXB38V]
RN5  4R-NEXB38V  [EXB38V]
T2  NMOSSOT23  [SOT-23]
U1  MICROSIM  [MICROSIM]
U6  A9G  [A9G]
U$20  HDR-1.27MM-14  [HDR-1.27MM-1*4]

### Nets
+3V3: DBG-COM1.P$9 R61.1 R67.2 U$20.P$4 ; also sheet 1,2,3,4,5,7,9
A9G_G_RXD: RN3.8 U6.49(UART2_RXD)
A9G_G_TXD: RN3.7 U6.50(UART2_TXD)
A9G_HST_RXD: DBG-COM1.P$1 U6.38(HST_RXD)
A9G_HST_TXD: DBG-COM1.P$2 U6.37(HST_TXD)
A9G_IO26: DBG-COM2.P$7 U6.25(IO26)
A9G_IO27: DBG-COM2.P$8 U6.26(IO27)
A9G_IO28: DBG-COM2.P$9 U6.30(IO28)
A9G_IO29: DBG-COM1.P$8 U6.24(IO29)
A9G_IO30: DBG-COM2.P$10 U6.31(IO30)
A9G_LCD_CS: DBG-COM1.P$7 U6.19(LCD_CS)
A9G_LCD_DIO: DBG-COM1.P$5 U6.21(LCD_DIO)
A9G_LCD_RST: DBG-COM1.P$6 U6.20(LCD_RST)
A9G_LCD_SCK: DBG-COM1.P$3 U6.23(LCD_SCK)
A9G_LCD_SDC: DBG-COM1.P$4 U6.22(LCD_SDC)
A9G_RXD: RN3.6 U6.53(UART1_RXD)
A9G_SD_CLK: DBG-COM2.P$6 U6.8(SD_CLK)
A9G_SD_CMD: DBG-COM2.P$5 U6.7(SD_CMD)
A9G_SD_D0: DBG-COM2.P$4 U6.6(SD_D0)
A9G_SD_D1: DBG-COM2.P$3 U6.5(SD_D1)
A9G_SD_D2: DBG-COM2.P$2 U6.4(SD_D2)
A9G_SD_D3: DBG-COM2.P$1 U6.3(SD_D3)
A9G_TXD: RN3.5 U6.54(UART1_TXD)
ESP_RX2: RN3.2 ; also sheet 1
ESP_TX2: RN3.1 ; also sheet 1
GND: C49.2 DBG-COM1.P$10 GPS.GND1 GPS.GND2 GPS.GND3 GSM.GND1 GSM.GND2 GSM.GND3 R49.2 R50.2 R65.2 RN5.2 RN5.3 T2.2(S) U1.5(GND) U6.10(GND) U6.27(GND) U6.29(GND) U6.44(GND) U6.46(GND) U$20.P$1 ; also sheet 1,2,3,4,5,6,7,9
GPS_RF: L5.1 R63.2 U6.28(GPS_RF)
GSM_RF: R62.2 U6.45(GPRS_RF)
IO14: R64.1 ; also sheet 1
IO27: T2.3(G) ; also sheet 1
N$4: R24.1 R49.1 U6.15(ADC0)
N$14: RN5.6 U6.33(MIC_N)
N$20: RN5.7 U6.14(SPK_N)
N$21: R61.2 R64.2 R65.1 U6.32(IO25)
N$22: T2.1(D) U6.18(RESET)
N$39: RN5.8 U6.13(SPK_P)
N$40: R66.1 U6.1(I2C2_SCL)
N$44: GSM.D R62.1
N$45: GPS.D R63.1
N$52: R70.2 U$20.P$2
N$53: R70.1 U6.2(I2C2_SDA)
N$55: RN5.5 U6.34(MIC_P)
N$56: R66.2 U$20.P$3
PWRKEY: R50.1 R67.1 U6.9(PWRKEY)
SIM_CLK: U1.3(CLK) U6.41(SM0_CLK) ; also sheet 7
SIM_DAT: U1.7(I/O) U6.39(SM0_DIO) ; also sheet 7
SIM_MICP: RN5.4 ; also sheet 7
SIM_RST: U1.2(RST) U6.42(SM0_RST) ; also sheet 7
SIM_SPKP: RN5.1 ; also sheet 7
SIM_VDD: C49.1 U1.1(VCC) U6.40(VSM0) ; also sheet 7
UART2/RX/PB1: RN3.4 ; also sheet 1
UART2/TX/PB0: RN3.3 ; also sheet 1
V_BAT_SUM: R24.2 U6.11(VBAT) U6.12(VBAT) ; also sheet 6,7
V_USB: U6.17(VUSB) ; also sheet 2,3,6
VIO: L5.2 U6.43(VIO)
Unconnected: U1.6(VPP) U6.16(ADC1) U6.35(USB_N) U6.36(USB_P) U6.47(UART2_RTS) U6.48(UART2_CTS) U6.51(UART1_RTS) U6.52(UART1_CTS)

### Notes on the sheet
- SIM card holder
- GSM Anten
- GPRS/GPS moudle

## Sheet 9 of 9: LCD FFC / Camera FFC / Camera Header (OV7670, OV2640)
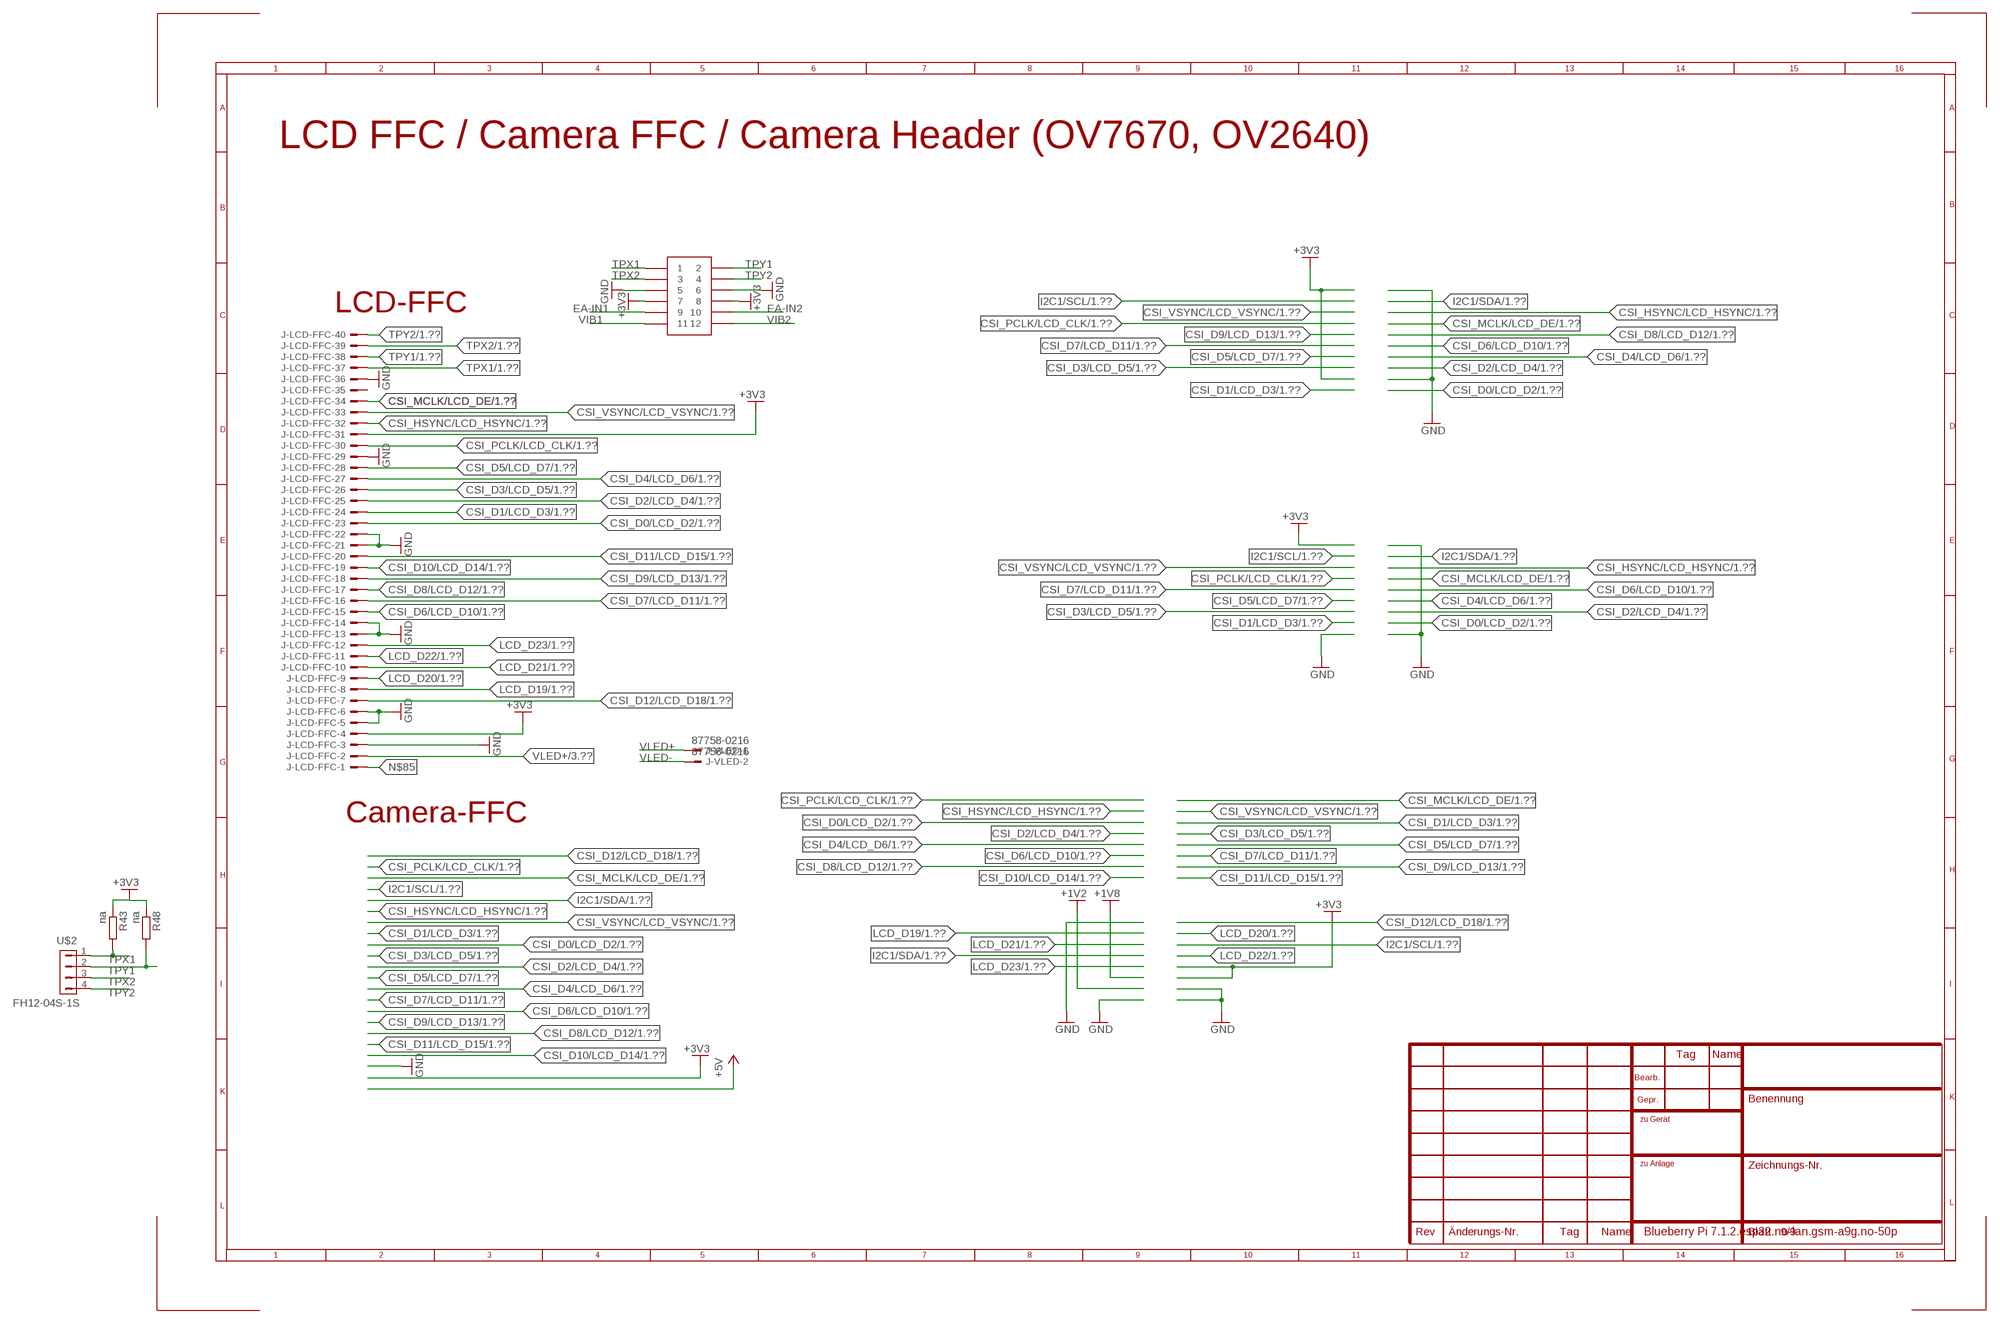
[diagram p9: schematic, sheet 9]

### Parts
J-LCD-FFC  40PINFPCH15-1LW  [XF2H-4015-1LW]
J-VLED  87758-0216  [87758-0216]
R43  na  R-EU_R0603  [R0603]
R48  na  R-EU_R0603  [R0603]
U$2  FH12-04S-1S  [FH12-04S-1SH]
U$18  HDR-1.27MM-62  [HDR-1.27MM-6*2]

### Nets
+3V3: J-LCD-FFC.4 J-LCD-FFC.31 R43.1 R48.1 U$18.P$7 U$18.P$8 ; also sheet 1,2,3,4,5,7,8
CSI_D0/LCD_D2: J-LCD-FFC.23 ; also sheet 1,4
CSI_D1/LCD_D3: J-LCD-FFC.24 ; also sheet 1,4
CSI_D2/LCD_D4: J-LCD-FFC.25 ; also sheet 1,4
CSI_D3/LCD_D5: J-LCD-FFC.26 ; also sheet 1,4
CSI_D4/LCD_D6: J-LCD-FFC.27 ; also sheet 1,4
CSI_D5/LCD_D7: J-LCD-FFC.28 ; also sheet 1,4
CSI_D6/LCD_D10: J-LCD-FFC.15 ; also sheet 1,4
CSI_D7/LCD_D11: J-LCD-FFC.16 ; also sheet 1,4
CSI_D8/LCD_D12: J-LCD-FFC.17 ; also sheet 1,4
CSI_D9/LCD_D13: J-LCD-FFC.18 ; also sheet 1,4
CSI_D10/LCD_D14: J-LCD-FFC.19 ; also sheet 1,4
CSI_D11/LCD_D15: J-LCD-FFC.20 ; also sheet 1,4
CSI_D12/LCD_D18: J-LCD-FFC.7 ; also sheet 1,4
CSI_HSYNC/LCD_HSYNC: J-LCD-FFC.32 ; also sheet 1,4
CSI_MCLK/LCD_DE: J-LCD-FFC.34 ; also sheet 1,4
CSI_PCLK/LCD_CLK: J-LCD-FFC.30 ; also sheet 1,4
CSI_VSYNC/LCD_VSYNC: J-LCD-FFC.33 ; also sheet 1,4
EA-IN1: U$18.P$9 ; also sheet 1
EA-IN2: U$18.P$10 ; also sheet 1
GND: J-LCD-FFC.3 J-LCD-FFC.5 J-LCD-FFC.6 J-LCD-FFC.13 J-LCD-FFC.14 J-LCD-FFC.21 J-LCD-FFC.22 J-LCD-FFC.29 J-LCD-FFC.36 U$18.P$5 U$18.P$6 ; also sheet 1,2,3,4,5,6,7,8
LCD_D19: J-LCD-FFC.8 ; also sheet 1,4
LCD_D20: J-LCD-FFC.9 ; also sheet 1,4
LCD_D21: J-LCD-FFC.10 ; also sheet 1,4
LCD_D22: J-LCD-FFC.11 ; also sheet 1,4
LCD_D23: J-LCD-FFC.12 ; also sheet 1,4
N$85: J-LCD-FFC.1
TPX1: J-LCD-FFC.37 R43.2 U$2.1 U$18.P$1 ; also sheet 1
TPX2: J-LCD-FFC.39 U$2.3 U$18.P$3 ; also sheet 1
TPY1: J-LCD-FFC.38 R48.2 U$2.2 U$18.P$2 ; also sheet 1
TPY2: J-LCD-FFC.40 U$2.4 U$18.P$4 ; also sheet 1
VIB1: U$18.P$11 ; also sheet 1
VIB2: U$18.P$12 ; also sheet 1
VLED+: J-LCD-FFC.2 J-VLED.1 ; also sheet 3
VLED-: J-VLED.2 ; also sheet 3
Unconnected: J-LCD-FFC.35

### Notes on the sheet
- LCD FFC / Camera FFC / Camera Header (OV7670, OV2640)
- LCD-FFC
- Camera-FFC

## Library data of the parts
C1-C3 C7-C30 C34 C36-C39 C44 C47 C50-C74 = rcl:C-EU: CAPACITOR, European symbol
C49 = Discrete:C*: Ceramic Capacitors
C76 C79 C81 C83-C85 = rcl@1:C-EU: CAPACITOR, European symbol; SPICEPREFIX: C
C77 = resistor:C-EU: CAPACITOR, European symbol
D1 D2 D6 D7 D9-D11 = diode:DIODE-: DIODE
DBG-COM1 DBG-COM2 = headers-1.27:HDR-1.27MM-1*10
GPS GSM = Connector:ANTENNA-U-FL
J2 = SparkFun-Connectors:AUDIO_JACK_TRRS: Audio Jack - 3.5mm TRRS (SMD) This is a 3.5mm TRRS SMD audio jack. TRRS connectors are the audio-style connectors that you see on some phones, MP3 players and development boards. TRRS stands for “tip, ring, ring, sleeve,” which reflects that this has three conductors and a ground. SparkFun Products: Audio Jack <https://www.sparkfun.com/products/12639> mbed Starter Kit <https://www.sparkfun.com/products/12968> SparkFun TRRS 3.5mm Jack Breakout <https://www.sparkfun.com/products/11570>; PROD_ID: CONN-10676; SF_ID: PRT-12639
J3 = Connectors:USB
J4 = EAGLE-FPC_CONNECTOR_AND_FFC_CAB-rev16b:68611514122: WR-FPC 1.00mm SMT ZIF Horizontal Top Contact, 15 Pins=>Code : Con_FPC_ZIF_1.00_68611514122 <http://katalog.we-online.de/media/images/eican/Con_FPC_ZIF_1.00_6861xx14122_pf2.jpg> Details see: http://katalog.we-online.de/en/em/686_1xx_141_22 Created 2014-07-09, Karrer Zheng 2014 (C) Würth Elektronik
J-AUDIO = srg:JST-PH_4-PIN_HEADER: 4-pin JST PH Shrouded Header, top entry P/N B4B-PH-K-S Mating connector PHR-4 Mating cable assembly: Sparkfun PRT-09916 <http://www.sparkfun.com/products/9916>
J-BAT = con-molex:87758-0416: 4 Pin - 2mm Dual Row Single Wafer, Vertical T/H HDR Source: http://www.molex.com/pdm_docs/sd/877580616_sd.pdf; MF: FARNELL; MPN: 87758-0416; OC_FARNELL: 7472315; OC_NEWARK: 39K3681
J-LCD-FFC = adafruit:40PINFPC: OMRON FPC Connector Source : http://www.omron.com/ecb/products/pdf/fpc.pdf XF2M-4015-rev is good for connecting up 'PSP' SHARP LQ043 LCDs
J-PWR2 = SparkFun-Connectors:CONN_02: Multi connection point. Often used as Generic Header-pin footprint for 0.1 inch spaced/style header connections On any of the 0.1 inch spaced packages, you can populate with these: Break Away Headers - Straight <https://www.sparkfun.com/products/116> (PRT-00116) Break Away Male Headers - Right Angle <https://www.sparkfun.com/products/553> (PRT-00553) Female Headers <https://www.sparkfun.com/products/115> (PRT-00115) Break Away Headers - Machine Pin <https://www.sparkfun.com/products/117> (PRT-00117) Break Away Female Headers - Swiss Machine Pin <https://www.sparkfun.com/products/743> (PRT-00743) For SCREWTERMINALS and SPRING TERMINALS visit here: Screw Terimnals on SparkFun.com <https://www.sparkfun.com/search/results?term=Screw+Terminals> (5mm/3.5mm/2.54mm spacing) This device is also useful as a general connection point to wire up your design to another part of your project. Our various solder wires solder well into these plated through hole pads. Hook-Up Wire - Assortment (Stranded, 22 AWG) <https://www.sparkfun.com/products/11375> (PRT-11375) Hook-Up Wire - Assortment (Solid Core, 22 AWG) <https://www.sparkfun.com/products/11367> (PRT-11367) View the entire wire category on our website here <https://www.sparkfun.com/categories/141> Special notes: Molex polarized connector foot print use with: PRT-08233 with associated crimp pins and housings. 2.54_SCREWTERM for use with PRT-10571. 3.5mm Screw Terminal footprints for PRT-08084 5mm Screw Terminal footprints for use with PRT-08432
J-VLED = con-molex:87758-0216: 2 Pin - 2mm Dual Row Single Wafer, Vertical T/H HDR Source: http://www.molex.com/pdm_docs/sd/877580616_sd.pdf; MPN: 87758-0216; OC_FARNELL: unknown; OC_NEWARK: 94M1513
JP1 = pinhead:PINHD-2X13: PIN HEADER
JP7 = pinhead:PINHD-1X3: PIN HEADER
L1 L4 L6-L8 = induct-CD:INDUCTANCE_CD32
L5 = Discrete:L*
LED1-LED3 LED5 = led:LED: LED OSRAM: - CHIPLED LG R971, LG N971, LY N971, LG Q971, LY Q971, LO R971, LY R971 LH N974, LH R974 LS Q976, LO Q976, LY Q976 LO Q996 - Hyper CHIPLED LW Q18S LB Q993, LB Q99A, LB R99A - SideLED LS A670, LO A670, LY A670, LG A670, LP A670 LB A673, LV A673, LT A673, LW A673 LH A674 LY A675 LS A676, LA A676, LO A676, LY A676, LW A676 LS A679, LY A679, LG A679 - Hyper Micro SIDELED® LS Y876, LA Y876, LO Y876, LY Y876 LT Y87S - SmartLED LW L88C, LW L88S LB L89C, LB L89S, LG L890 LS L89K, LO L89K, LY L89K LS L896, LA L896, LO L896, LY L896 - TOPLED LS T670, LO T670, LY T670, LG T670, LP T670 LSG T670, LSP T670, LSY T670, LOP T670, LYG T670 LG T671, LOG T671, LSG T671 LB T673, LV T673, LT T673, LW T673 LH T674 LS T676, LA T676, LO T676, LY T676, LB T676, LH T676, LSB T676, LW T676 LB T67C, LV T67C, LT T67C, LS T67K, LO T67K, LY T67K, LW E67C LS E67B, LA E67B, LO E67B, LY E67B, LB E67C, LV E67C, LT E67C LW T67C LS T679, LY T679, LG T679 LS T770, LO T770, LY T770, LG T770, LP T770 LB T773, LV T773, LT T773, LW T773 LH T774 LS E675, LA E675, LY E675, LS T675 LS T776, LA T776, LO T776, LY T776, LB T776 LHGB T686 LT T68C, LB T68C - Hyper Mini TOPLED® LB M676 - Mini TOPLED Santana® LG M470 LS M47K, LO M47K, LY M47K Source: http://www.osram.convergy.de LUXEON: - LUMILED® LXK2-PW12-R00, LXK2-PW12-S00, LXK2-PW14-U00, LXK2-PW14-V00 LXK2-PM12-R00, LXK2-PM12-S00, LXK2-PM14-U00 LXK2-PE12-Q00, LXK2-PE12-R00, LXK2-PE12-S00, LXK2-PE14-T00, LXK2-PE14-U00 LXK2-PB12-K00, LXK2-PB12-L00, LXK2-PB12-M00, LXK2-PB14-N00, LXK2-PB14-P00, LXK2-PB14-Q00 LXK2-PR12-L00, LXK2-PR12-M00, LXK2-PR14-Q00, LXK2-PR14-R00 LXK2-PD12-Q00, LXK2-PD12-R00, LXK2-PD12-S00 LXK2-PH12-R00, LXK2-PH12-S00 LXK2-PL12-P00, LXK2-PL12-Q00, LXK2-PL12-R00 Source: www.luxeon.com KINGBRIGHT: KA-3528ASYC Source: www.kingbright.com
MIC = microphon:ELECTRET_MICROPHON-: Electret Condenser Microphone
Q1 = crystal:CRYSTAL: CRYSTAL; OC_FARNELL: 1666969; OC_NEWARK: unknown
Q2 = crystal:CRYSTAL: CRYSTAL; OC_FARNELL: unknown; OC_NEWARK: unknown
R1-R6 R8 R11-R18 R20-R23 R25-R33 R36 R38 R39 R43-R48 R51-R60 R68 R69 = rcl:R-EU_: RESISTOR, European symbol
R24 R49 R50 R61-R67 R70 = Discrete:R*
RN1-RN3 RN5 = resistor-dil:4R-N: Array Chip Resistor Source: RS Component / Phycomp; OC_FARNELL: unknown; OC_NEWARK: unknown
S-BOOT-ESP S-RST S-RST-ESP S-SEL S-START S-VOL+ S-VOL- = my_but:BUTTON_3X3MM_4PINS
T1 T2 = zetex:NMOSSOT23: MOS FET; OC_FARNELL: unknown; OC_NEWARK: unknown
U1 = Connector:MICROSIM
U2 = SparkFun-IC-Memory:W25Q32FV: W25Q32FV 32Mb (4MB) Serial Flash Memory The W25Q32FV support the standard Serial Peripheral Interface (SPI), Dual/Quad I/O SPI as well as 2-clocks instruction cycle Quad Peripheral Interface (QPI). 104MHz, SPI, 8-SOIC-EIAJ Datasheet <http://www.winbond.com/resource-files/w25q32fv%20revh%20091613.pdf> SparkFun Products SparkFun Blynk Board - ESP8266 <https://www.sparkfun.com/products/13794> (WRL-13794); PROD_ID: NA-XXXXX
U4 = esp32-1:ESP-WROOM-32: Espressif Systems ESP-WROOM-32
U5 = memory-winbond:W25Q40BV: EEPROM 4 Mbit SPI Serial Flash with Dual and Quad SPI
U6 = IC:A9G
U$1 = Allwinner V3s:V3S
U$2 = con-hirose:FH12-04S-1S
U$3 = headers-1.27:HDR-1.27MM-14*2
U$4 = headers-1.27:HDR-1.27MM-4*2
U$5 U$12 U$13 = dcdc:STI3411
U$6 U$14 = mcp73831:MCP73831: Miniature Single-Cell, Fully Integrated Li-Ion, Li-Polymer Charge Management Controllers
U$7 = tsc2003:TSC2003
U$9 U$10 = PT4101:PT4101
U$11 = microsd:MICROSD-PUSH-OUT: T-Flash Push-Out Micro SD Card Reader 14.75mm x 14.5mm SMD with external pins
U$15 = XC6204:XC6204
U$16 = Synapseware:S25FLSXXX: S25FL128S and S25FL256S S25FL128S 128 Mbit (16 Mbyte) S25FL256S 256 Mbit (32 Mbyte) MirrorBit ® Flash Non-Volatile Memory CMOS 3.0 Volt Core with Versatile I/O Serial Peripheral Interface with Multi-I/O
U$17 U$21 = con-hirose:FH12-06S-0.5S
U$18 = headers-1.27:HDR-1.27MM-6*2
U$19 U$24 = ts5a23157:TS5A23157
U$20 = headers-1.27:HDR-1.27MM-1*4
USB_OTG = OLIMEX_CONNECTORS:MINI_USB9
X2 = con-molex:53?-02: CONNECTOR wire to board 1.25 mm (.049 inch) pitch header; MF: MOLEX; MPN: 53047-0210; OC_FARNELL: 9733051; OC_NEWARK: 57H4701

## Net classes
0 default: clearance 0.355 mm